# EAGLE design duckypad (EAGLE 9.6.2)
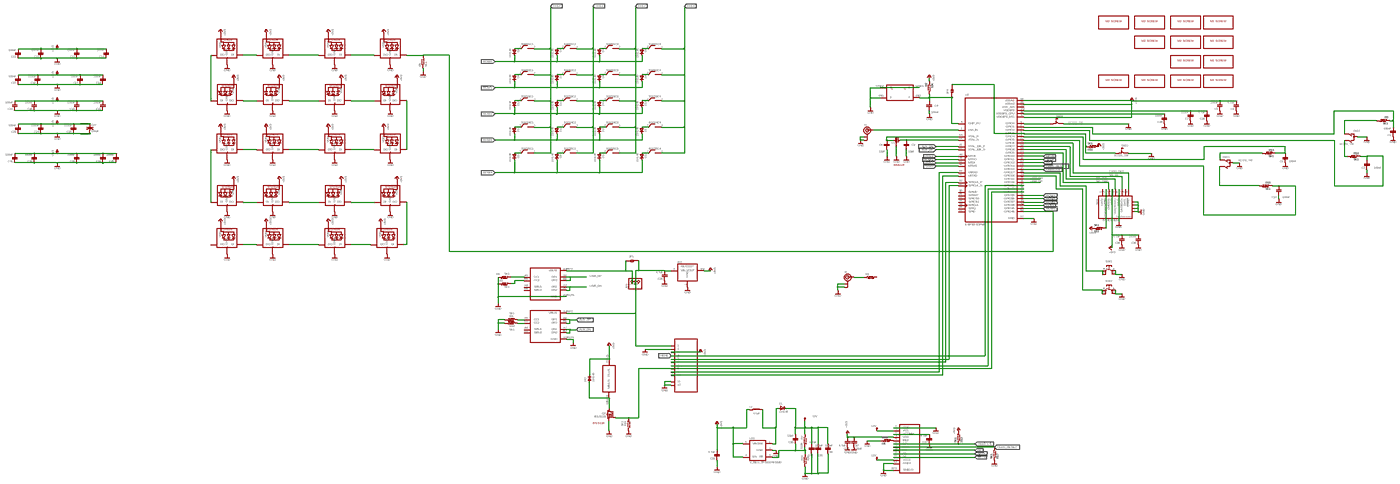
[diagram p0: schematic, sheet 1, overview]
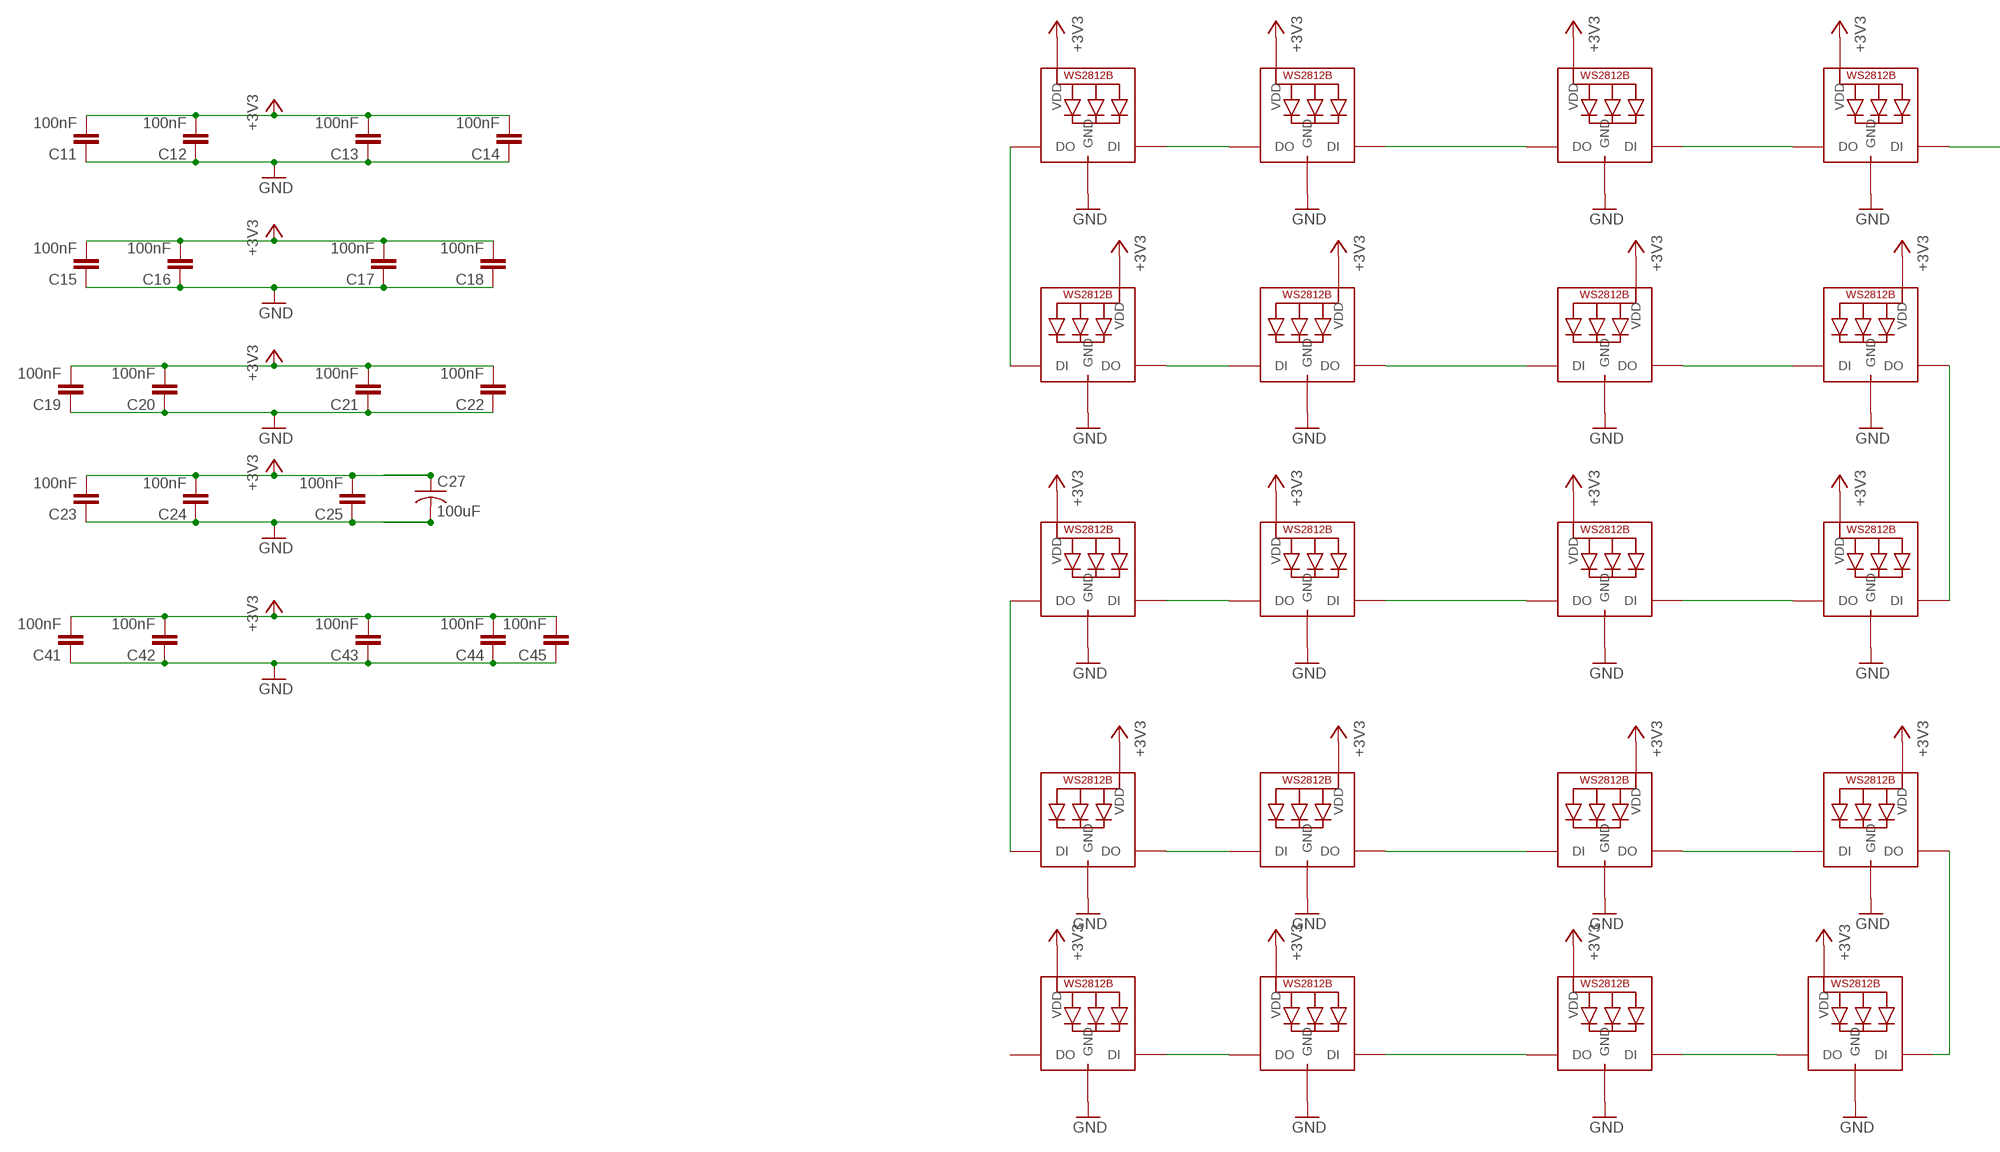
[diagram p1: schematic, sheet 1, part 1 of 4]
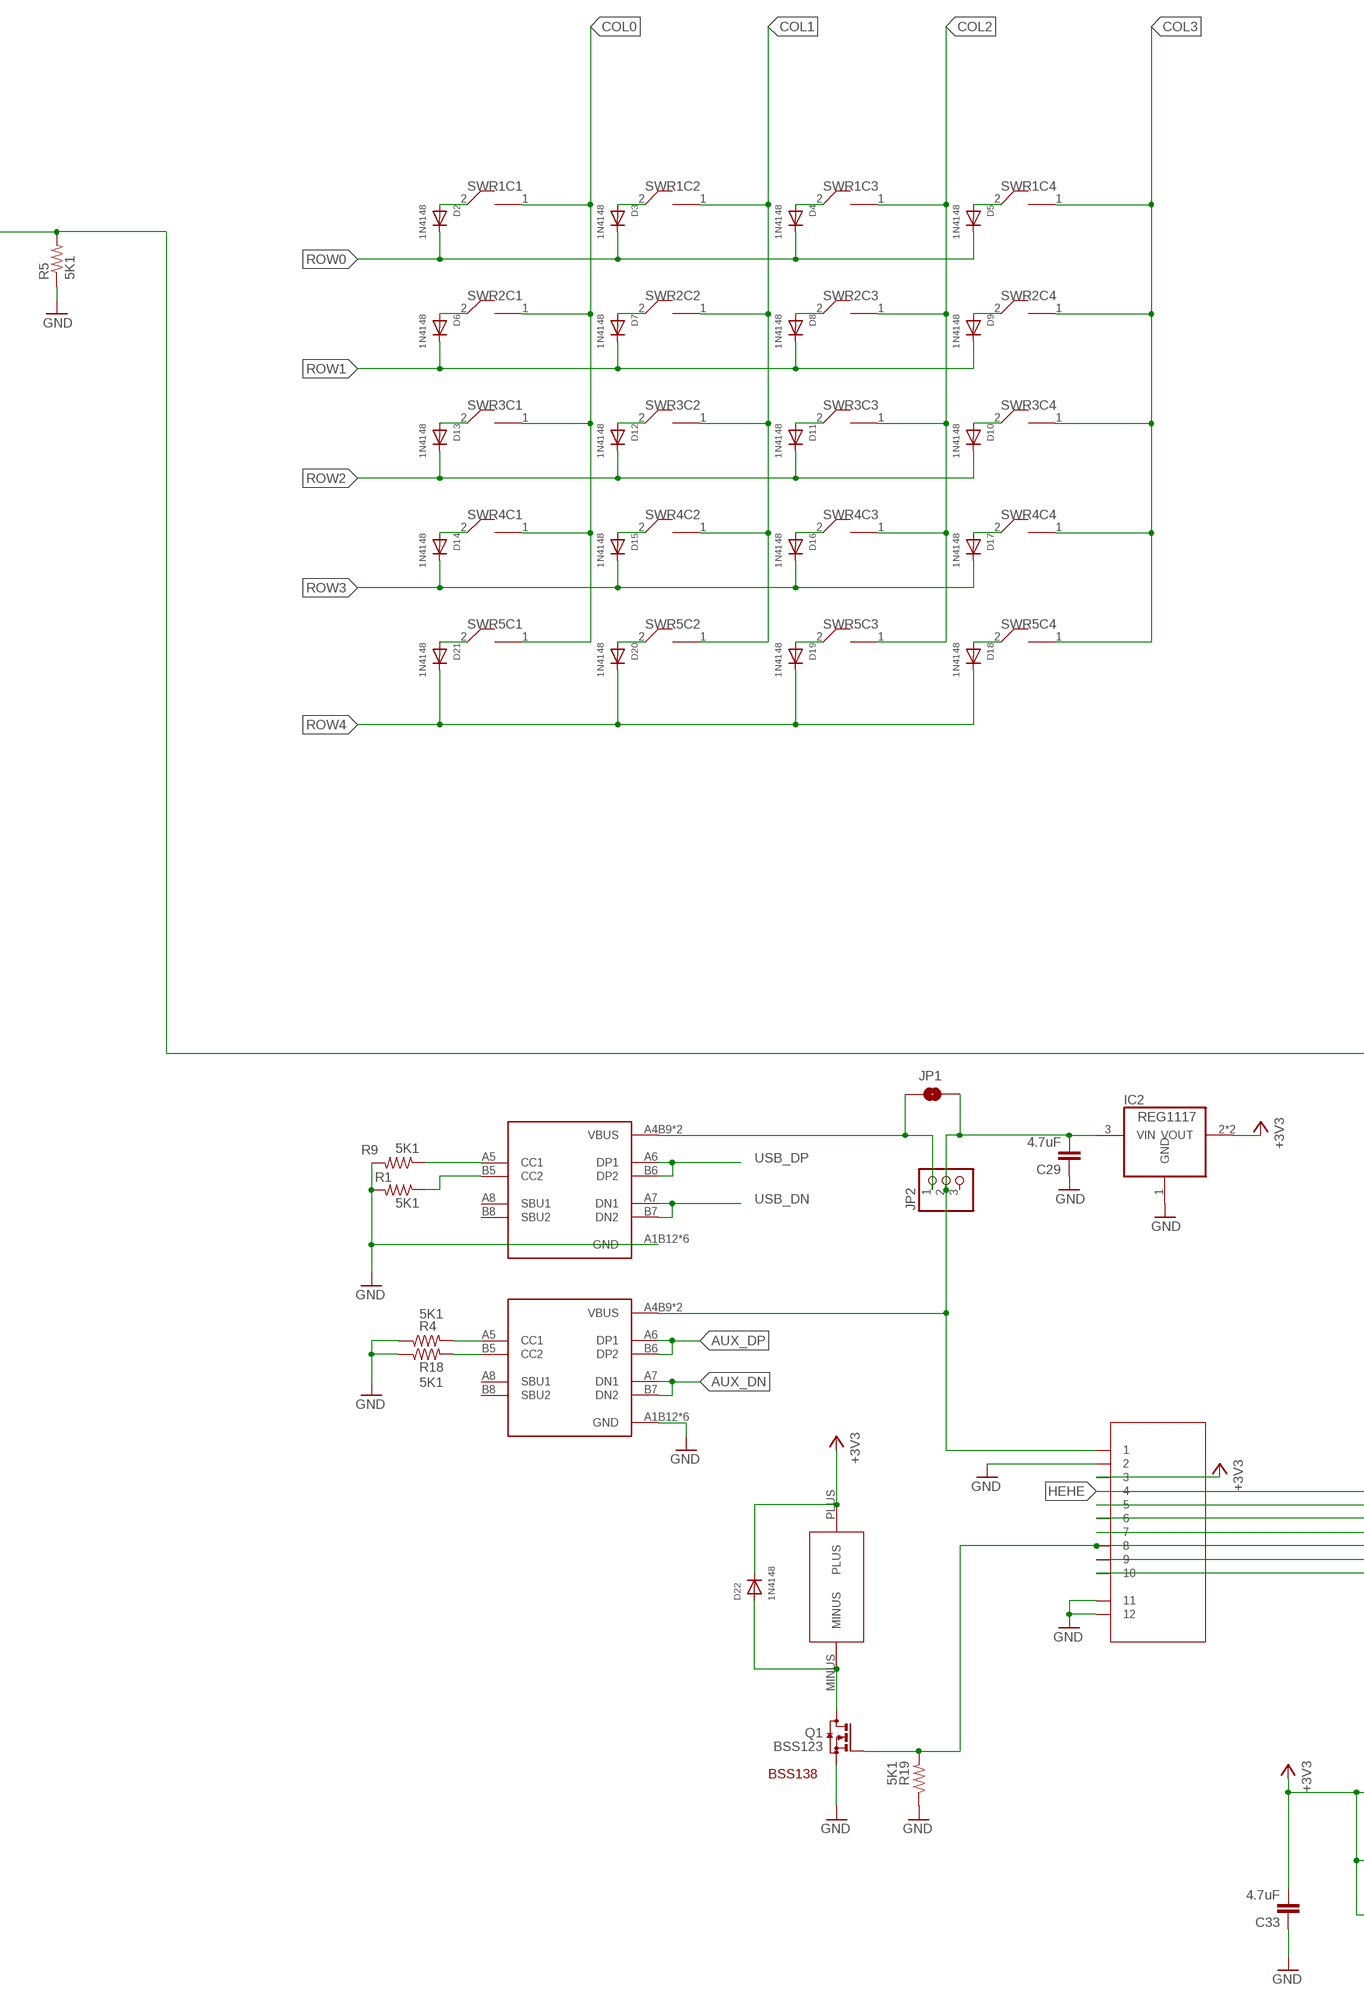
[diagram p2: schematic, sheet 1, part 2 of 4]
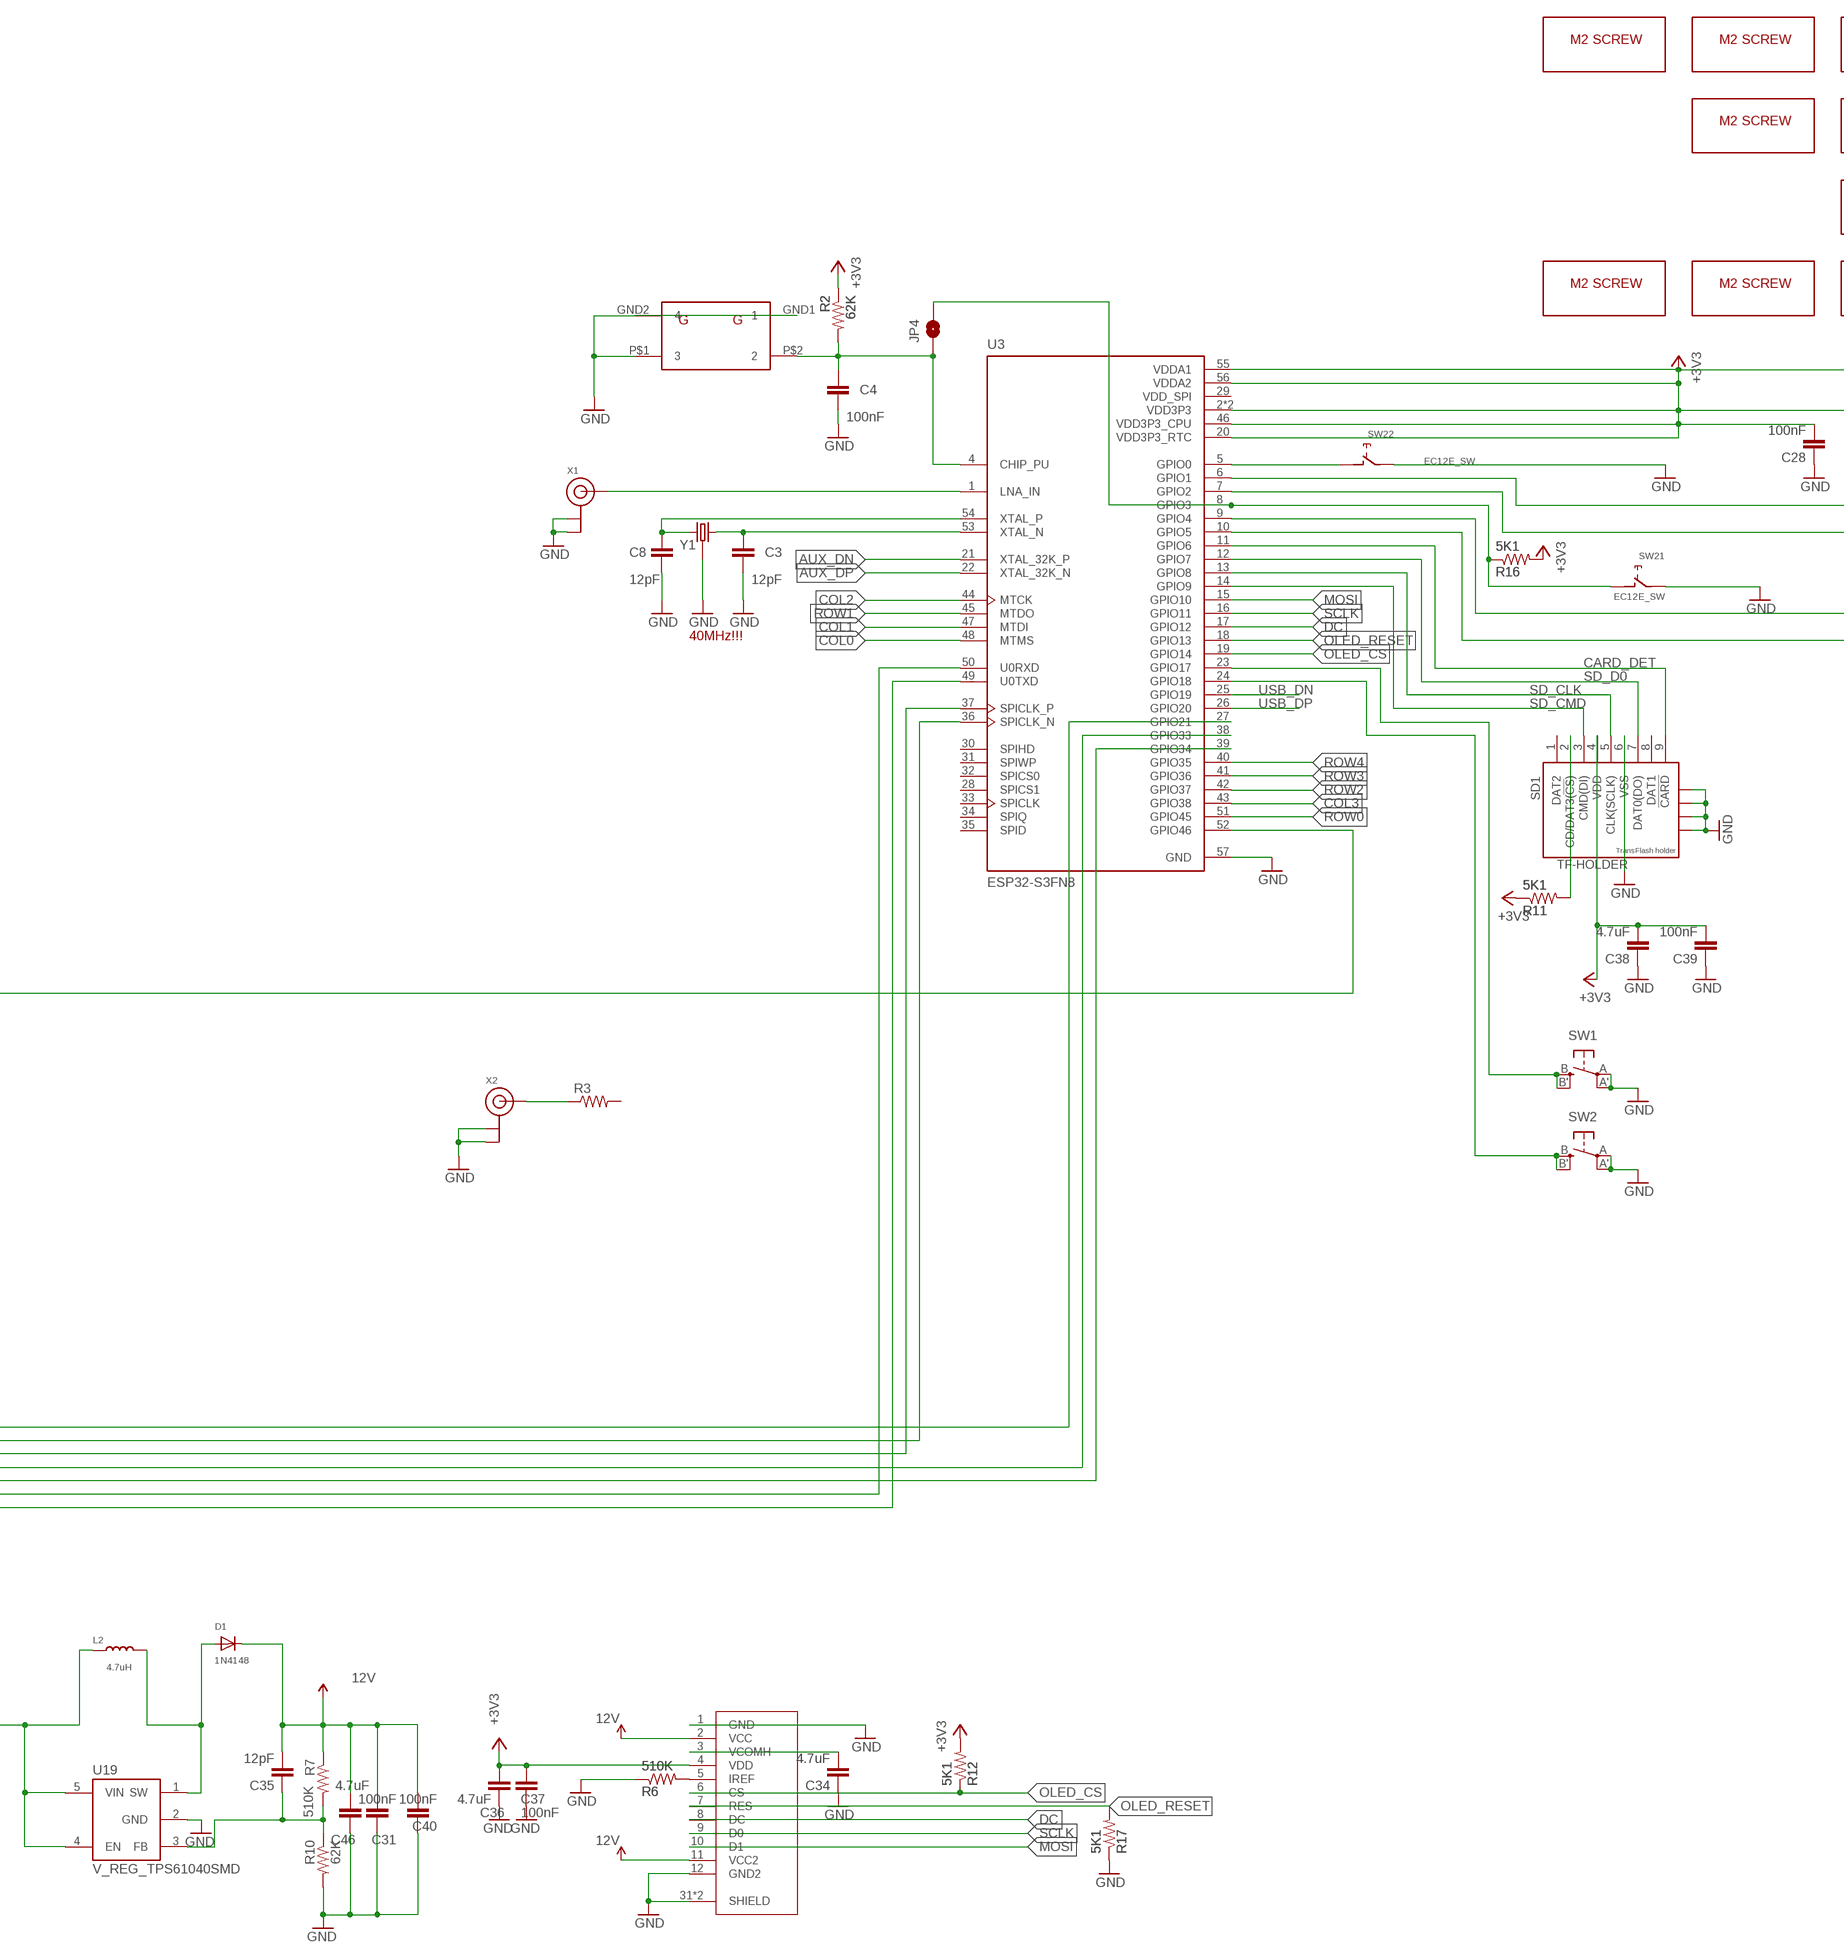
[diagram p3: schematic, sheet 1, part 3 of 4]
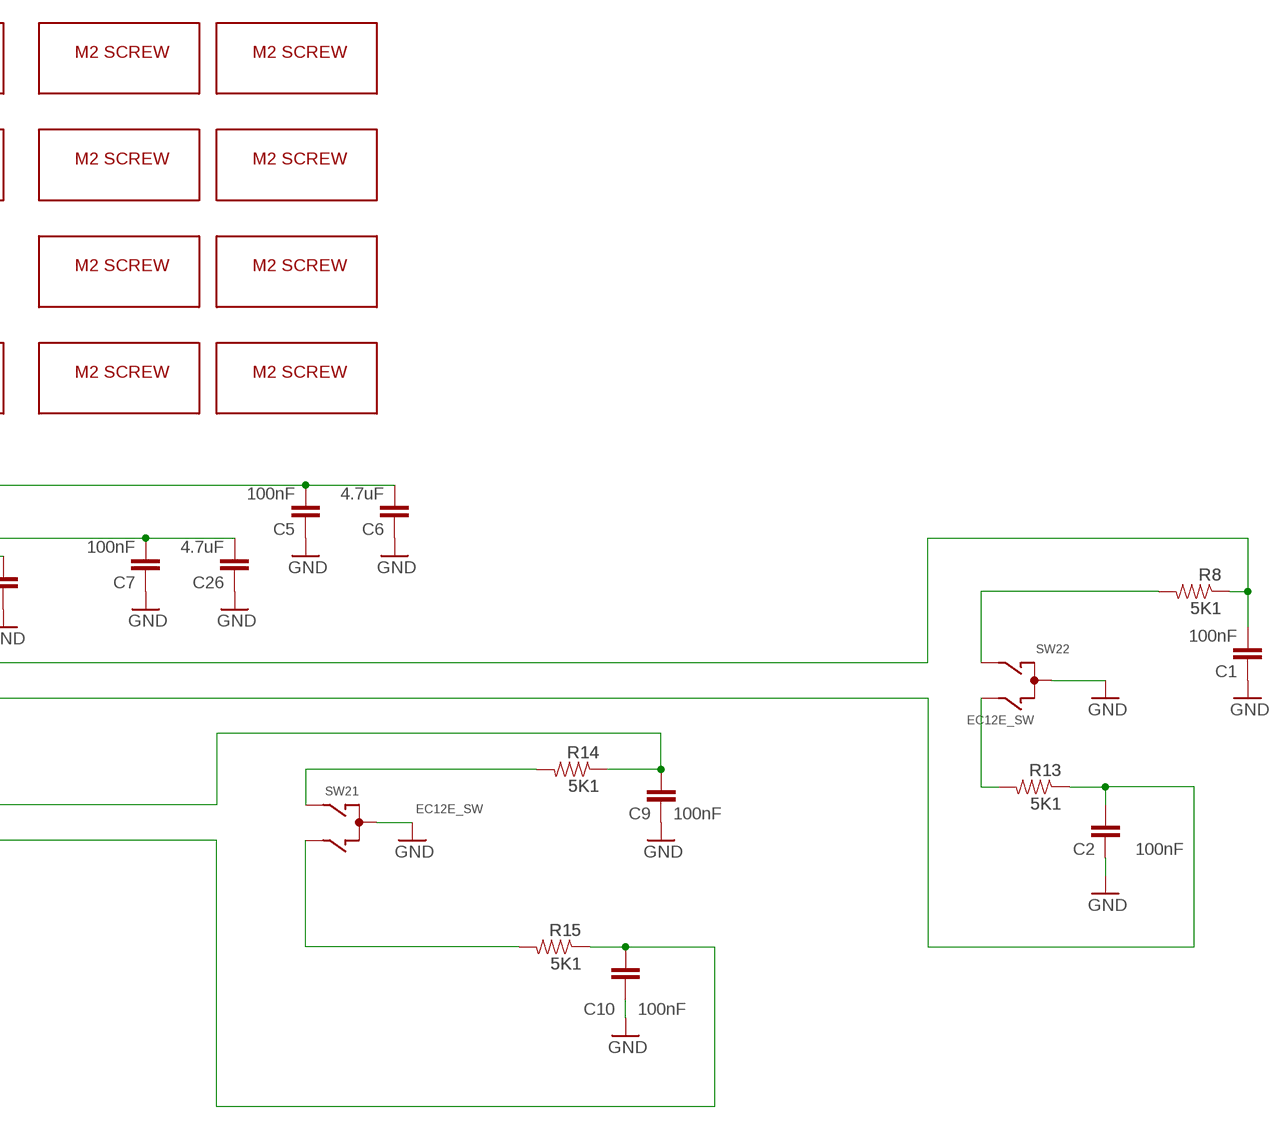
[diagram p4: schematic, sheet 1, part 4 of 4]

## Parts
BZ1  BUZZ40402  [BUZZ]
C1  100nF  CAP0805  [0805]
C2  100nF  CAP0805  [0805]
C3  12pF  CAP0805  [0805]
C4  100nF  CAP0805  [0805]
C5  100nF  CAP0805  [0805]
C6  4.7uF  CAP0805  [0805]
C7  100nF  CAP0805  [0805]
C8  12pF  CAP0805  [0805]
C9  100nF  CAP0805  [0805]
C10  100nF  CAP0805  [0805]
C11  100nF  CAP0805  [0805]
C12  100nF  CAP0805  [0805]
C13  100nF  CAP0805  [0805]
C14  100nF  CAP0805  [0805]
C15  100nF  CAP0805  [0805]
C16  100nF  CAP0805  [0805]
C17  100nF  CAP0805  [0805]
C18  100nF  CAP0805  [0805]
C19  100nF  CAP0805  [0805]
C20  100nF  CAP0805  [0805]
C21  100nF  CAP0805  [0805]
C22  100nF  CAP0805  [0805]
C23  100nF  CAP0805  [0805]
C24  100nF  CAP0805  [0805]
C25  100nF  CAP0805  [0805]
C26  4.7uF  CAP0805  [0805]
C27  100uF  C-USC1210  [C1210]
C28  100nF  CAP0805  [0805]
C29  4.7uF  CAP0805  [0805]
C31  100nF  CAP0805  [0805]
C33  4.7uF  CAP0805  [0805]
C34  4.7uF  CAP0805  [0805]
C35  12pF  CAP0805  [0805]
C36  4.7uF  CAP0805  [0805]
C37  100nF  CAP0805  [0805]
C38  4.7uF  CAP0805  [0805]
C39  100nF  CAP0805  [0805]
C40  100nF  CAP0805  [0805]
C41  100nF  CAP0805  [0805]
C42  100nF  CAP0805  [0805]
C43  100nF  CAP0805  [0805]
C44  100nF  CAP0805  [0805]
C45  100nF  CAP0805  [0805]
C46  4.7uF  CAP0805  [0805]
D1  1N4148  ADAFRUIT_CHANGED_DIODESOD-123  [ADAFRUIT_CHANGED_SOD-123]
D2  1N4148  ADAFRUIT_CHANGED_DIODESOD-123  [ADAFRUIT_CHANGED_SOD-123]
D3  1N4148  ADAFRUIT_CHANGED_DIODESOD-123  [ADAFRUIT_CHANGED_SOD-123]
D4  1N4148  ADAFRUIT_CHANGED_DIODESOD-123  [ADAFRUIT_CHANGED_SOD-123]
D5  1N4148  ADAFRUIT_CHANGED_DIODESOD-123  [ADAFRUIT_CHANGED_SOD-123]
D6  1N4148  ADAFRUIT_CHANGED_DIODESOD-123  [ADAFRUIT_CHANGED_SOD-123]
D7  1N4148  ADAFRUIT_CHANGED_DIODESOD-123  [ADAFRUIT_CHANGED_SOD-123]
D8  1N4148  ADAFRUIT_CHANGED_DIODESOD-123  [ADAFRUIT_CHANGED_SOD-123]
D9  1N4148  ADAFRUIT_CHANGED_DIODESOD-123  [ADAFRUIT_CHANGED_SOD-123]
D10  1N4148  ADAFRUIT_CHANGED_DIODESOD-123  [ADAFRUIT_CHANGED_SOD-123]
D11  1N4148  ADAFRUIT_CHANGED_DIODESOD-123  [ADAFRUIT_CHANGED_SOD-123]
D12  1N4148  ADAFRUIT_CHANGED_DIODESOD-123  [ADAFRUIT_CHANGED_SOD-123]
D13  1N4148  ADAFRUIT_CHANGED_DIODESOD-123  [ADAFRUIT_CHANGED_SOD-123]
D14  1N4148  ADAFRUIT_CHANGED_DIODESOD-123  [ADAFRUIT_CHANGED_SOD-123]
D15  1N4148  ADAFRUIT_CHANGED_DIODESOD-123  [ADAFRUIT_CHANGED_SOD-123]
D16  1N4148  ADAFRUIT_CHANGED_DIODESOD-123  [ADAFRUIT_CHANGED_SOD-123]
D17  1N4148  ADAFRUIT_CHANGED_DIODESOD-123  [ADAFRUIT_CHANGED_SOD-123]
D18  1N4148  ADAFRUIT_CHANGED_DIODESOD-123  [ADAFRUIT_CHANGED_SOD-123]
D19  1N4148  ADAFRUIT_CHANGED_DIODESOD-123  [ADAFRUIT_CHANGED_SOD-123]
D20  1N4148  ADAFRUIT_CHANGED_DIODESOD-123  [ADAFRUIT_CHANGED_SOD-123]
D21  1N4148  ADAFRUIT_CHANGED_DIODESOD-123  [ADAFRUIT_CHANGED_SOD-123]
D22  1N4148  ADAFRUIT_CHANGED_DIODESOD-123  [ADAFRUIT_CHANGED_SOD-123]
IC2  REG1117  [SOT223]
JP1  JUMPER-SMT_2_NO_NO-SILK  [SMT-JUMPER_2_NO_NO-SILK]
JP2  PINHD-1X3CB  [1X03-CLEANBIG]
JP4  JUMPER-SMT_2_NO_NO-SILK  [SMT-JUMPER_2_NO_NO-SILK]
L2  4.7uH  L-4030  [L4030]
LED_R1C1  WS2812B  [REVERSE_MNT]
LED_R1C2  WS2812B  [REVERSE_MNT]
LED_R1C3  WS2812B  [REVERSE_MNT]
LED_R1C4  WS2812B  [REVERSE_MNT]
LED_R2C1  WS2812B  [REVERSE_MNT]
LED_R2C2  WS2812B  [REVERSE_MNT]
LED_R2C3  WS2812B  [REVERSE_MNT]
LED_R2C4  WS2812B  [REVERSE_MNT]
LED_R3C1  WS2812B  [REVERSE_MNT]
LED_R3C2  WS2812B  [REVERSE_MNT]
LED_R3C3  WS2812B  [REVERSE_MNT]
LED_R3C4  WS2812B  [REVERSE_MNT]
LED_R4C1  WS2812B  [REVERSE_MNT]
LED_R4C2  WS2812B  [REVERSE_MNT]
LED_R4C3  WS2812B  [REVERSE_MNT]
LED_R4C4  WS2812B  [REVERSE_MNT]
LED_R5C1  WS2812B  [REVERSE_MNT]
LED_R5C2  WS2812B  [REVERSE_MNT]
LED_R5C3  WS2812B  [REVERSE_MNT]
LED_R5C4  WS2812B  [REVERSE_MNT]
Q1  BSS123  [SOT23]
R1  5K1  RESISTOR0805-RES  [0805]
R2  62K  RESISTOR0805-RES  [0805]
R3  R-US_R2010  [R2010]
R4  5K1  RESISTOR0805-RES  [0805]
R5  5K1  RESISTOR0805-RES  [0805]
R6  510K  RESISTOR0805-RES  [0805]
R7  510K  RESISTOR0805-RES  [0805]
R8  5K1  RESISTOR0805-RES  [0805]
R9  5K1  RESISTOR0805-RES  [0805]
R10  62K  RESISTOR0805-RES  [0805]
R11  5K1  RESISTOR0805-RES  [0805]
R12  5K1  RESISTOR0805-RES  [0805]
R13  5K1  RESISTOR0805-RES  [0805]
R14  5K1  RESISTOR0805-RES  [0805]
R15  5K1  RESISTOR0805-RES  [0805]
R16  5K1  RESISTOR0805-RES  [0805]
R17  5K1  RESISTOR0805-RES  [0805]
R18  5K1  RESISTOR0805-RES  [0805]
R19  5K1  RESISTOR0805-RES  [0805]
SD1  TF-HOLDER  [TF-PULL]
SH1  SH10P  [DUCKYPAD_SM12B-SSR-H-TB]
SW1  SPST_TACT-EVQQ2  [EVQ-Q2]
SW2  SPST_TACT-EVQQ2  [EVQ-Q2]
SW3  3POS_SLIDE_SWITCH_324_SW  [SIDEPUSH]
SW21  EC12E_SW  [ALPS_EC12E_SW]
SW22  EC12E_SW  [ALPS_EC12E_SW]
SWR1C1  KAILH_SWITCH_SOCKET_KAILH_SWITCH_SOCKET  [KAILH_SWITCH_SOCKET_SWITCH_SOCKET]
SWR1C2  KAILH_SWITCH_SOCKET_KAILH_SWITCH_SOCKET  [KAILH_SWITCH_SOCKET_SWITCH_SOCKET]
SWR1C3  KAILH_SWITCH_SOCKET_KAILH_SWITCH_SOCKET  [KAILH_SWITCH_SOCKET_SWITCH_SOCKET]
SWR1C4  KAILH_SWITCH_SOCKET_KAILH_SWITCH_SOCKET  [KAILH_SWITCH_SOCKET_SWITCH_SOCKET]
SWR2C1  KAILH_SWITCH_SOCKET_KAILH_SWITCH_SOCKET  [KAILH_SWITCH_SOCKET_SWITCH_SOCKET]
SWR2C2  KAILH_SWITCH_SOCKET_KAILH_SWITCH_SOCKET  [KAILH_SWITCH_SOCKET_SWITCH_SOCKET]
SWR2C3  KAILH_SWITCH_SOCKET_KAILH_SWITCH_SOCKET  [KAILH_SWITCH_SOCKET_SWITCH_SOCKET]
SWR2C4  KAILH_SWITCH_SOCKET_KAILH_SWITCH_SOCKET  [KAILH_SWITCH_SOCKET_SWITCH_SOCKET]
SWR3C1  KAILH_SWITCH_SOCKET_KAILH_SWITCH_SOCKET  [KAILH_SWITCH_SOCKET_SWITCH_SOCKET]
SWR3C2  KAILH_SWITCH_SOCKET_KAILH_SWITCH_SOCKET  [KAILH_SWITCH_SOCKET_SWITCH_SOCKET]
SWR3C3  KAILH_SWITCH_SOCKET_KAILH_SWITCH_SOCKET  [KAILH_SWITCH_SOCKET_SWITCH_SOCKET]
SWR3C4  KAILH_SWITCH_SOCKET_KAILH_SWITCH_SOCKET  [KAILH_SWITCH_SOCKET_SWITCH_SOCKET]
SWR4C1  KAILH_SWITCH_SOCKET_KAILH_SWITCH_SOCKET  [KAILH_SWITCH_SOCKET_SWITCH_SOCKET]
SWR4C2  KAILH_SWITCH_SOCKET_KAILH_SWITCH_SOCKET  [KAILH_SWITCH_SOCKET_SWITCH_SOCKET]
SWR4C3  KAILH_SWITCH_SOCKET_KAILH_SWITCH_SOCKET  [KAILH_SWITCH_SOCKET_SWITCH_SOCKET]
SWR4C4  KAILH_SWITCH_SOCKET_KAILH_SWITCH_SOCKET  [KAILH_SWITCH_SOCKET_SWITCH_SOCKET]
SWR5C1  KAILH_SWITCH_SOCKET_KAILH_SWITCH_SOCKET  [KAILH_SWITCH_SOCKET_SWITCH_SOCKET]
SWR5C2  KAILH_SWITCH_SOCKET_KAILH_SWITCH_SOCKET  [KAILH_SWITCH_SOCKET_SWITCH_SOCKET]
SWR5C3  KAILH_SWITCH_SOCKET_KAILH_SWITCH_SOCKET  [KAILH_SWITCH_SOCKET_SWITCH_SOCKET]
SWR5C4  KAILH_SWITCH_SOCKET_KAILH_SWITCH_SOCKET  [KAILH_SWITCH_SOCKET_SWITCH_SOCKET]
U1  USBC_16P  [USBC_16P_FOOT]
U2  USBC_16P  [USBC_16P_FOOT]
U3  ESP32-S3FN8  [QFN40P700X700X90-57N]
U19  V_REG_TPS61040SMD  [SOT23-5]
U$2  OLED_OLED128  [OLED_LUL_UG-2864HSWEG01_1.3_WRAPAROUND]
U$7  M2_SCREW_DEV  [M2_SCREW_FOOT]
U$8  M2_SCREW_DEV  [M2_SCREW_FOOT]
U$9  M2_SCREW_DEV  [M2_SCREW_FOOT]
U$11  M2_SCREW_DEV  [M2_SCREW_FOOT]
U$12  M2_SCREW_DEV  [M2_SCREW_FOOT]
U$13  M2_SCREW_DEV  [M2_SCREW_FOOT]
U$14  M2_SCREW_DEV  [M2_SCREW_FOOT]
U$15  M2_SCREW_DEV  [M2_SCREW_FOOT]
U$16  M2_SCREW_DEV  [M2_SCREW_FOOT]
U$17  M2_SCREW_DEV  [M2_SCREW_FOOT]
U$20  M2_SCREW_DEV  [M2_SCREW_FOOT]
U$21  M2_SCREW_DEV  [M2_SCREW_FOOT]
U$22  M2_SCREW_DEV  [M2_SCREW_FOOT]
X1  ANTENNA_U.FL  [U.FL]
X2  ANTENNA_U.FL  [U.FL]
Y1  16MHz_12pF  CRYSTAL-26MHZSMD-3.2X2.5  [CRYSTAL-SMD-3.2X2.5MM]

## Nets
12V: C31.2 C35.2 C40.2 C46.2 D1.C R7.1 U$2.2(VCC) U$2.11(VCC2)
+3V3: BZ1.PLUS C5.2 C6.2 C7.2 C11.2 C12.2 C13.2 C14.2 C15.2 C16.2 C17.2 C18.2 C19.2 C20.2 C21.2 C22.2 C23.2 C24.2 C25.2 C26.2 C27.1 C28.2 C33.2 C36.2 C37.2 C38.2 C39.2 C41.2 C42.2 C43.2 C44.2 C45.2 D22.C IC2.2(VOUT) IC2.4(VOUT) L2.1 LED_R1C1.VDD LED_R1C2.VDD LED_R1C3.VDD LED_R1C4.VDD LED_R2C1.VDD LED_R2C2.VDD LED_R2C3.VDD LED_R2C4.VDD LED_R3C1.VDD LED_R3C2.VDD LED_R3C3.VDD LED_R3C4.VDD LED_R4C1.VDD LED_R4C2.VDD LED_R4C3.VDD LED_R4C4.VDD LED_R5C1.VDD LED_R5C2.VDD LED_R5C3.VDD LED_R5C4.VDD R2.1 R11.1 R12.2 R16.2 SD1.4(VDD) SH1.3 U3.2(VDD3P3) U3.3(VDD3P3) U3.20(VDD3P3_RTC) U3.46(VDD3P3_CPU) U3.55(VDDA1) U3.56(VDDA2) U19.4(EN) U19.5(VIN) U$2.4(VDD)
AUX_DN: U1.A7(DN1) U1.B7(DN2) U3.21(XTAL_32K_P)
AUX_DP: U1.A6(DP1) U1.B6(DP2) U3.22(XTAL_32K_N)
CARD_DET: SD1.9(!CARD) U3.11(GPIO6)
COL0: SWR1C1.1 SWR2C1.1 SWR3C1.1 SWR4C1.1 SWR5C1.1 U3.48(MTMS)
COL1: SWR1C2.1 SWR2C2.1 SWR3C2.1 SWR4C2.1 SWR5C2.1 U3.47(MTDI)
COL2: SWR1C3.1 SWR2C3.1 SWR3C3.1 SWR4C3.1 SWR5C3.1 U3.44(MTCK)
COL3: SWR1C4.1 SWR2C4.1 SWR3C4.1 SWR4C4.1 SWR5C4.1 U3.43(GPIO38)
DC: U3.17(GPIO12) U$2.8(DC)
GND: C1.1 C2.1 C3.2 C4.2 C5.1 C6.1 C7.1 C8.2 C9.1 C10.1 C11.1 C12.1 C13.1 C14.1 C15.1 C16.1 C17.1 C18.1 C19.1 C20.1 C21.1 C22.1 C23.1 C24.1 C25.1 C26.1 C27.2 C28.1 C29.1 C31.1 C33.1 C34.1 C36.1 C37.1 C38.1 C39.1 C40.1 C41.1 C42.1 C43.1 C44.1 C45.1 C46.1 IC2.1(GND) LED_R1C1.GND LED_R1C2.GND LED_R1C3.GND LED_R1C4.GND LED_R2C1.GND LED_R2C2.GND LED_R2C3.GND LED_R2C4.GND LED_R3C1.GND LED_R3C2.GND LED_R3C3.GND LED_R3C4.GND LED_R4C1.GND LED_R4C2.GND LED_R4C3.GND LED_R4C4.GND LED_R5C1.GND LED_R5C2.GND LED_R5C3.GND LED_R5C4.GND Q1.2(S) R1.2 R4.1 R5.1 R6.1 R9.2 R10.2 R17.1 R18.1 R19.1 SD1.6(VSS) SD1.S1 SD1.S2 SD1.S3 SD1.S4 SH1.2 SH1.FIT@1 SH1.FIT@2 SW1.A'(P1) SW1.A(P) SW2.A'(P1) SW2.A(P) SW3.GND1 SW3.GND2 SW3.P$1 SW21.C SW21.E SW22.C SW22.E U1.A1B12(GND) U1.B11A12(GND) U1.P$13(GND) U1.P$14(GND) U1.P$15(GND) U1.P$16(GND) U2.A1B12(GND) U2.B11A12(GND) U2.P$13(GND) U2.P$14(GND) U2.P$15(GND) U2.P$16(GND) U3.57(GND) U19.2(GND) U$2.1(GND) U$2.12(GND2) U$2.31(SHIELD) U$2.32(SHIELD) X1.1(GND) X1.2(GND) X2.1(GND) X2.2(GND) Y1.2 Y1.4
HEHE: SH1.4 U3.27(GPIO21)
MOSI: U3.15(GPIO10) U$2.10(D1)
N$1: JP1.1 JP2.1 U2.A4B9(VBUS) U2.B4A9(VBUS)
N$2: LED_R1C3.DIN(DI) LED_R1C4.DOUT(DO)
N$3: LED_R1C2.DIN(DI) LED_R1C3.DOUT(DO)
N$4: LED_R1C1.DIN(DI) LED_R1C2.DOUT(DO)
N$5: LED_R1C1.DOUT(DO) LED_R2C1.DIN(DI)
N$6: LED_R2C1.DOUT(DO) LED_R2C2.DIN(DI)
N$7: LED_R2C2.DOUT(DO) LED_R2C3.DIN(DI)
N$8: C34.2 U$2.3(VCOMH)
N$9: LED_R2C3.DOUT(DO) LED_R2C4.DIN(DI)
N$10: R6.2 U$2.5(IREF)
N$11: LED_R2C4.DOUT(DO) LED_R3C4.DIN(DI)
N$12: LED_R3C3.DIN(DI) LED_R3C4.DOUT(DO)
N$13: LED_R3C2.DIN(DI) LED_R3C3.DOUT(DO)
N$14: C9.2 R14.1 U3.9(GPIO4)
N$15: LED_R3C1.DIN(DI) LED_R3C2.DOUT(DO)
N$16: LED_R3C1.DOUT(DO) LED_R4C1.DIN(DI)
N$17: LED_R4C1.DOUT(DO) LED_R4C2.DIN(DI)
N$18: LED_R4C2.DOUT(DO) LED_R4C3.DIN(DI)
N$19: LED_R4C3.DOUT(DO) LED_R4C4.DIN(DI)
N$20: LED_R4C4.DOUT(DO) LED_R5C4.DIN(DI)
N$21: LED_R5C3.DIN(DI) LED_R5C4.DOUT(DO)
N$22: LED_R5C2.DIN(DI) LED_R5C3.DOUT(DO)
N$23: LED_R5C1.DIN(DI) LED_R5C2.DOUT(DO)
N$24: C8.1 U3.54(XTAL_P) Y1.1
N$25: C3.1 U3.53(XTAL_N) Y1.3
N$26: U3.1(LNA_IN) X1.3(SIGNAL)
N$27: D5.A SWR1C4.2
N$28: SW22.D U3.5(GPIO0)
N$29: LED_R1C4.DIN(DI) R5.2 U3.52(GPIO46)
N$30: SW1.B'(S1) SW1.B(S) U3.23(GPIO17)
N$31: R1.1 U2.B5(CC2)
N$32: R4.2 U1.A5(CC1)
N$33: R9.1 U2.A5(CC1)
N$34: R8.2 SW22.A
N$35: R13.2 SW22.B
N$36: D1.A L2.2 U19.1(SW)
N$37: BZ1.MINUS D22.A Q1.3(D)
N$38: C1.2 R8.1 U3.6(GPIO1)
N$39: C35.1 R7.2 R10.1 U19.3(FB)
N$40: C2.2 R13.1 U3.7(GPIO2)
N$41: JP4.2 R16.1 SW21.D U3.8(GPIO3)
N$42: R15.2 SW21.B
N$43: R11.2 SD1.2(CD/DAT3(!CS!))
N$44: D4.A SWR1C3.2
N$45: D3.A SWR1C2.2
N$46: D2.A SWR1C1.2
N$47: D9.A SWR2C4.2
N$48: R14.2 SW21.A
N$49: C10.2 R15.1 U3.10(GPIO5)
N$50: D8.A SWR2C3.2
N$51: D7.A SWR2C2.2
N$52: D6.A SWR2C1.2
N$53: D10.A SWR3C4.2
N$54: D11.A SWR3C3.2
N$55: D12.A SWR3C2.2
N$56: D13.A SWR3C1.2
N$57: D17.A SWR4C4.2
N$58: D16.A SWR4C3.2
N$59: D15.A SWR4C2.2
N$60: D14.A SWR4C1.2
N$61: D18.A SWR5C4.2
N$62: D19.A SWR5C3.2
N$63: D20.A SWR5C2.2
N$64: D21.A SWR5C1.2
N$65: SW2.B'(S1) SW2.B(S) U3.24(GPIO18)
N$66: C29.2 IC2.3(VIN) JP1.2 JP2.2 SH1.1 U1.A4B9(VBUS) U1.B4A9(VBUS)
N$67: SH1.5 U3.36(SPICLK_N)
N$68: SH1.6 U3.37(SPICLK_P)
N$69: SH1.7 U3.38(GPIO33)
N$70: Q1.1(G) R19.2 SH1.8 U3.39(GPIO34)
N$71: R3.1 X2.3(SIGNAL)
N$72: SH1.9 U3.50(U0RXD)
N$73: SH1.10 U3.49(U0TXD)
N$80: R18.2 U1.B5(CC2)
OLED_CS: R12.1 U3.19(GPIO14) U$2.6(CS)
OLED_RESET: R17.2 U3.18(GPIO13) U$2.7(RES)
RESET: C4.1 JP4.1 R2.2 SW3.P$2 U3.4(CHIP_PU)
ROW0: D2.C D3.C D4.C D5.C U3.51(GPIO45)
ROW1: D6.C D7.C D8.C D9.C U3.45(MTDO)
ROW2: D10.C D11.C D12.C D13.C U3.42(GPIO37)
ROW3: D14.C D15.C D16.C D17.C U3.41(GPIO36)
ROW4: D18.C D19.C D20.C D21.C U3.40(GPIO35)
SCLK: U3.16(GPIO11) U$2.9(D0)
SD_CLK: SD1.5(CLK(SCLK)) U3.13(GPIO8)
SD_CMD: SD1.3(CMD(DI)) U3.14(GPIO9)
SD_D0: SD1.7(DAT0(DO)) U3.12(GPIO7)
USB_DN: U2.A7(DN1) U2.B7(DN2) U3.25(GPIO19)
USB_DP: U2.A6(DP1) U2.B6(DP2) U3.26(GPIO20)
Unconnected: JP2.3 LED_R5C1.DOUT(DO) R3.2 SD1.1(DAT2) SD1.8(DAT1) SW21.GND1(G) SW21.GND2(G) SW22.GND1(G) SW22.GND2(G) U1.A8(SBU1) U1.B8(SBU2) U2.A8(SBU1) U2.B8(SBU2) U3.28(SPICS1) U3.30(SPIHD) U3.31(SPIWP) U3.32(SPICS0) U3.33(SPICLK) U3.34(SPIQ) U3.35(SPID)

## Notes on the sheet
- 40MHz!!!
- BSS138

## Power pins joined to a net without a drawn wire
VDD_SPI: U3.29(VDD_SPI)

## Library data of the parts
BZ1 = duckypad:BUZZ40402
C1-C26 C28 C29 C31 C33-C46 = clock:CAP: Capacitor Standard 0603 ceramic capacitor, and 0.1" leaded capacitor.
C27 = clock:C-US: CAPACITOR, American symbol
D1-D22 = duckypad:ADAFRUIT_CHANGED_DIODE: Diode SMADIODE - SMA Surface Mount Package 20V 1A Schottky Diode Digikey: 641-1014-6-ND DO-1N4148 - Through Hole Small Current Diode SOD-123 20V 1 A (.5mV Vf) Schottky Diode - Digikey: MBRX120TPMSCT-ND SOD-323 10V 570mA (.38mV Vf, 3ns) Schottky Diode - Digikey: ZLLS410CT-ND SOD-523 30V 30mA Schottky Diode (RB751S-40TE61) - Digikey: RB751S-40TE61CT-ND SOT23-R/W - SOT23 Package (R = Solder Paste/Reflow Ovens, W = Hand-Soldering) BAT54Film 40V 300mA - Digikey: 497-7162-1-ND
IC2 = clock:REG1117: 800mA and 1A Low Dropout (LDO) Positive Regulator 1.8V, 2.5V, 2.85V, 3.3V, 5V, and Adj; MPN: REG1117; OC_FARNELL: 1097566; OC_NEWARK: 14P6981
JP1 JP4 = SparkFun-Jumpers:JUMPER-SMT_2_NO: Normally open jumper This jumper has two pads in close proximity to each other. Apply solder to close the connection. Round pads are easier to solder for beginners, but are a lot larger. SparkFun Product that uses the round pads: SparkFun EL Sequencer <https://www.sparkfun.com/products/12781>
JP2 = adafruit_changed:PINHD-1X3: PIN HEADER
L2 = Discrete:L*
LED_R1C1-LED_R1C4 LED_R2C1-LED_R2C4 LED_R3C1-LED_R3C4 LED_R4C1-LED_R4C4 LED_R5C1-LED_R5C4 = duckypad:WS2812B
Q1 = transistor-small-signal:BSS123: N-CHANNEL MOS FET
R1 R2 R4 R6-R19 = joyAnalog:RESISTOR: Resistor Basic schematic elements and footprints for 0603, 1206, and PTH resistors.
R3 = adafruit_changed:R-US_: RESISTOR, American symbol
R5 = clock:RESISTOR: Resistor Basic schematic elements and footprints for 0603, 1206, and PTH resistors.
SD1 = clock:TF-HOLDER: TF / Micro SD socket is PUSH-PUSH type, the card can be pushed into and auto locked and pushed out by simply press the card. Surface Mounting type.
SH1 = duckypad:SH10P
SW1 SW2 = duckypad:SPST_TACT: SMT 6mm switch, EVQQ2 series http://www.ladyada.net/library/eagle
SW3 = duckypad:3POS_SLIDE_SWITCH_324_SW
SW21 SW22 = switch-alps:EC12E_SW: ALPS rotary Encoder EC12E series with switch; MPN: EC12E2424407; OC_FARNELL: 1520813; OC_NEWARK: 74M1068
SWR1C1-SWR1C4 SWR2C1-SWR2C4 SWR3C1-SWR3C4 SWR4C1-SWR4C4 SWR5C1-SWR5C4 = lul:KAILH_SWITCH_SOCKET_KAILH_SWITCH_SOCKET
U1 U2 = my_usbc_16p:USBC_16P
U3 = ESP32-S3FN8:ESP32-S3FN8: Check availability <https://pricing.snapeda.com/parts/ESP32-S3FN8/Espressif%20Systems/view-part?ref=eda> Check availability <https://pricing.snapeda.com/parts/ESP32-S3FN8/Espressif%20Systems/view-part?ref=eda> Check availability <https://pricing.snapeda.com/parts/ESP32-S3FN8/Espressif%20Systems/view-part?ref=eda>; AVAILABILITY: In Stock; CHECK_PRICES: https://www.snapeda.com/parts/ESP32-S3FN8/Espressif+Systems/view-part/?ref=eda; DESCRIPTION: Espressif Systems [ENGINEERING SAMPLES]SMD IC , Dual-Core MCU, Wi-Fi 2.4G & BLE 5.0 combo, 8 MB Octal SPI PSRAM, QFN 56-pin, 7*7 mm; MF: Espressif Systems; MP: ESP32-S3FN8; PACKAGE: None; PRICE: None; SNAPEDA_LINK: https://www.snapeda.com/parts/ESP32-S3FN8/Espressif+Systems/view-part/?ref=snap
U19 = SparkFun-Retired:V_REG_TPS61040
U$2 = duckypad:OLED_OLED128
U$7-U$9 U$11-U$17 U$20-U$22 = duckypad:M2_SCREW_DEV
X1 X2 = adafruit_changed:ANTENNA_U.FL: U.FL Antenna Connector
Y1 = SparkFun-Clocks:CRYSTAL-26MHZ: 26MHz Crystal w/ Ground Pin Digikey Example <http://www.digikey.com/product-detail/en/epson/TSX-3225%2026.0000MF09Z-AC3/SER3627CT-ND/1802878> Frequency: 26MHz Frequency Stability: ±9ppm Frequency Tolerance: ±10ppm Load Capacitance: 9pF SparkFun Products: SparkFun ESP32 Thing <https://www.sparkfun.com/products/13907> SparkFun ESP8266 Thing Dev Board <https://www.sparkfun.com/products/13711>; PROD_ID: XTAL-12454

## Board
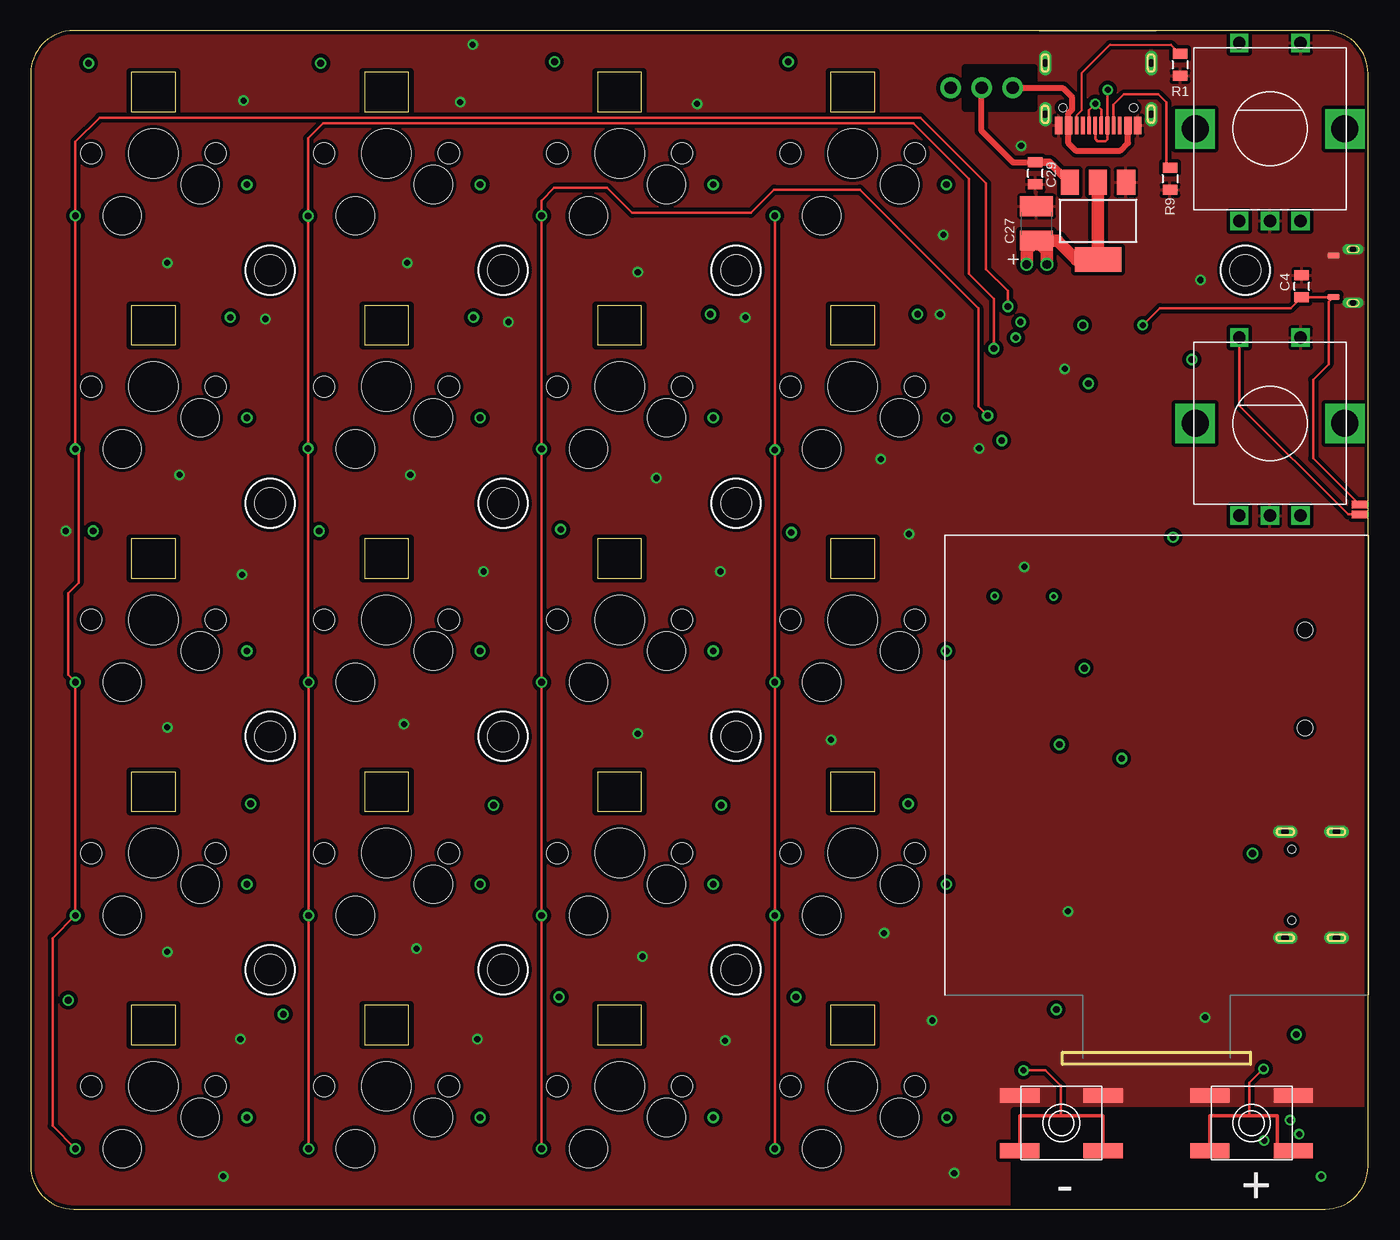
[diagram p5: board, top side]
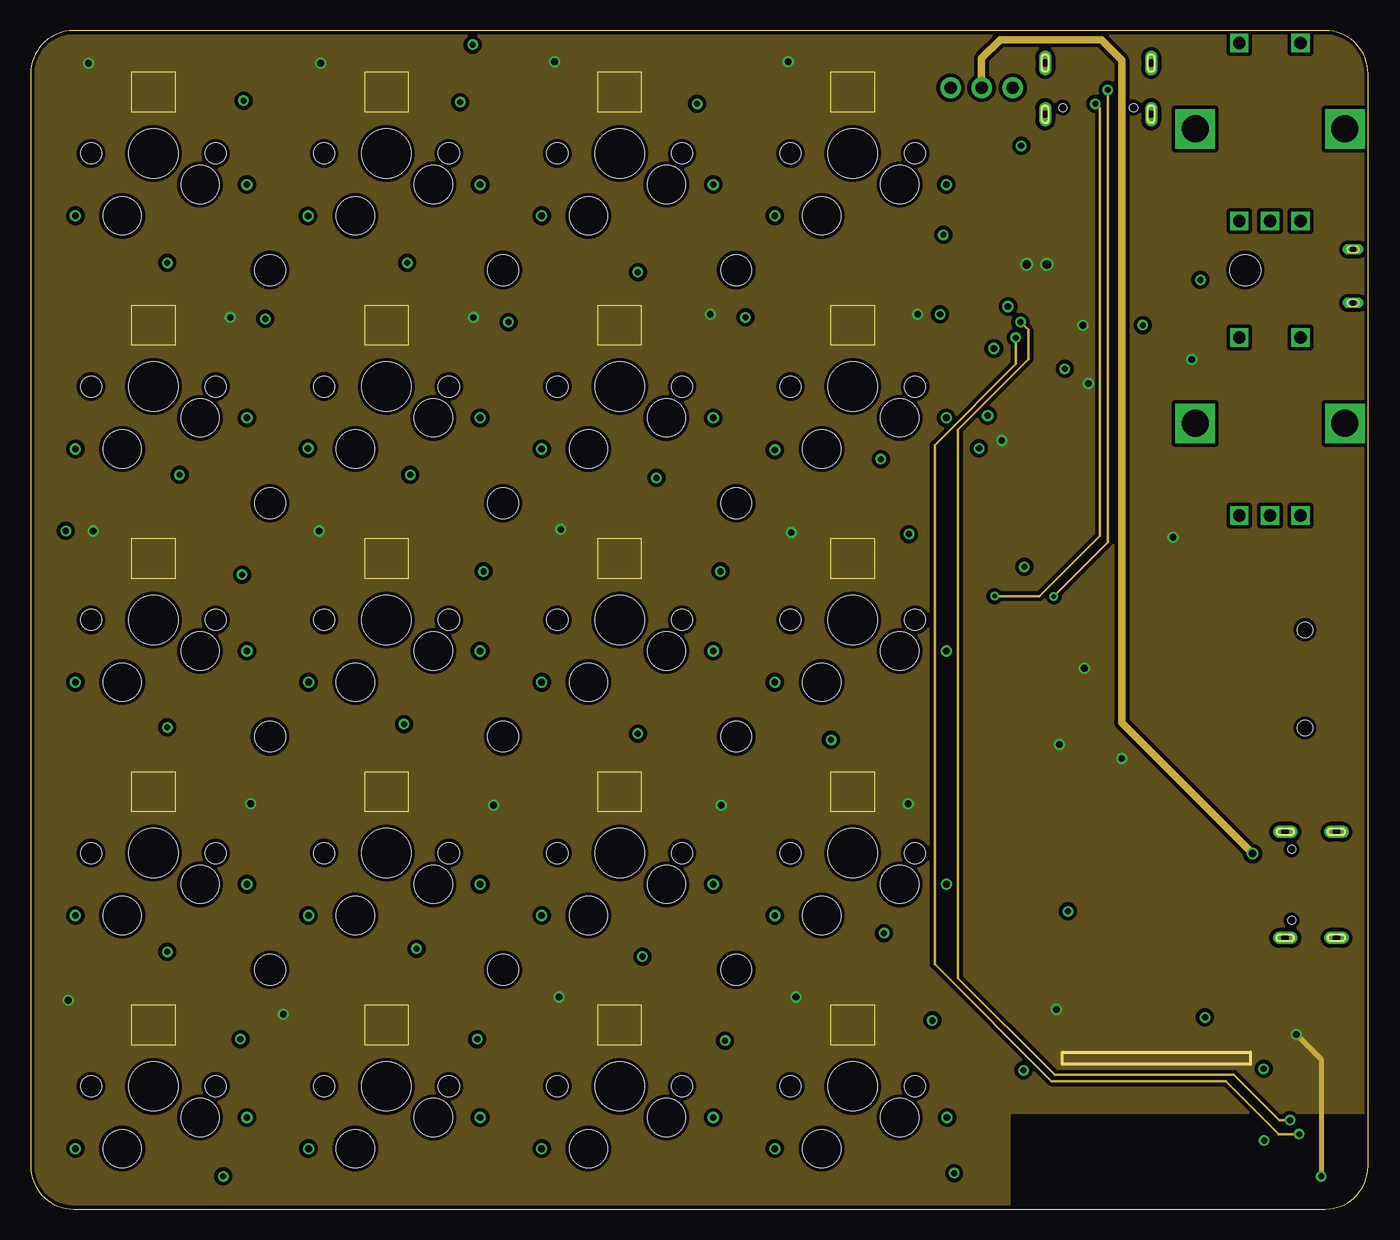
[diagram p6: board, inner layer pwr]
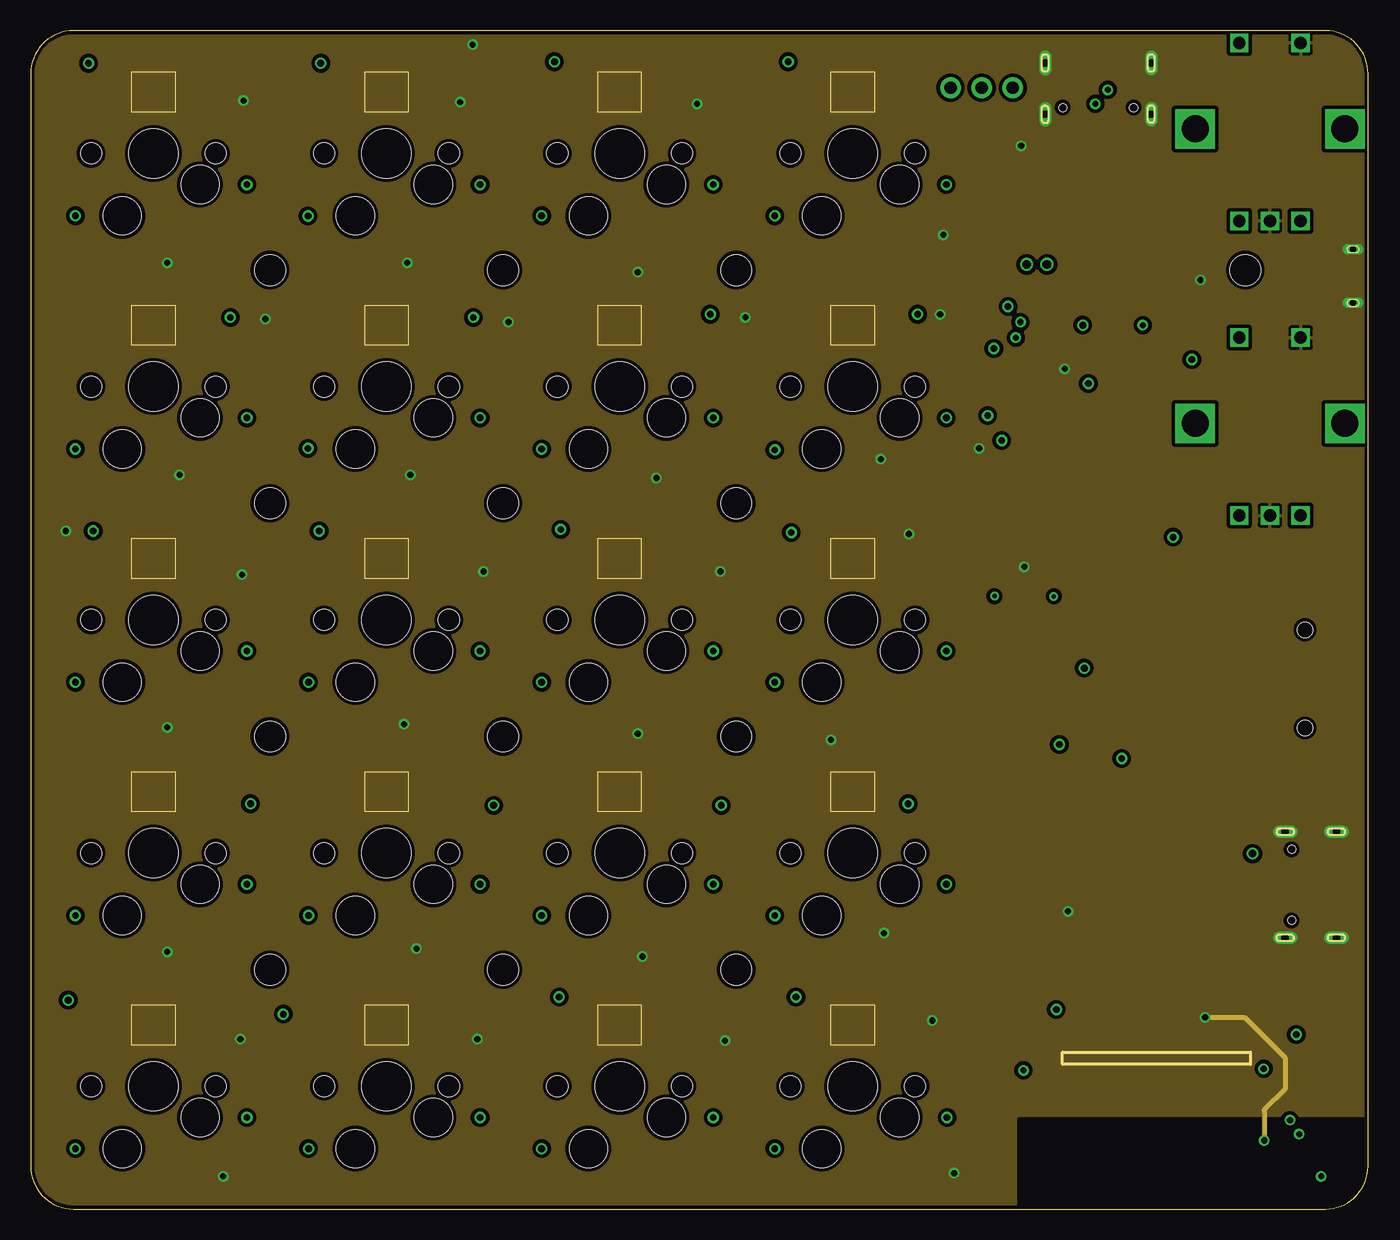
[diagram p7: board, inner layer gnd]
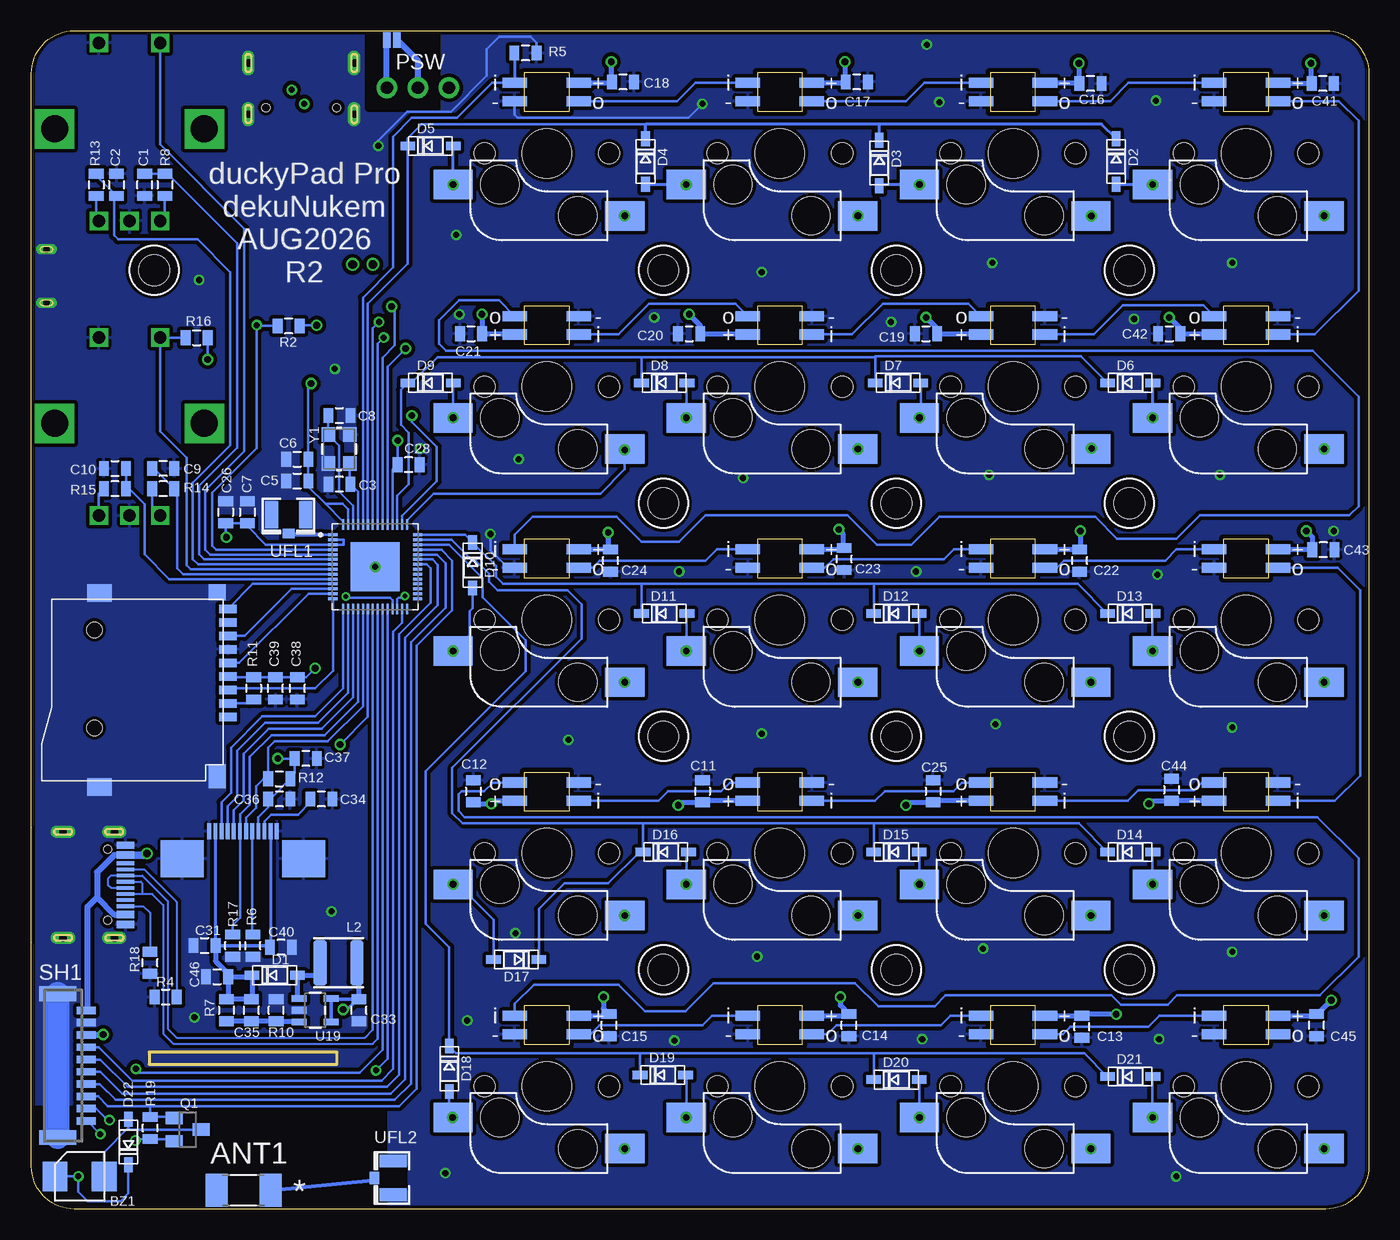
[diagram p8: board, bottom side, seen from below]

Size 109 x 96 mm. Coordinates in mm from the lower left corner, seen from the top.
Outline: 105.5,96 3.5,96 arc90 0,92.5 0,3.5 arc90 3.5,0 105.5,0 arc90 109,3.5 109,92.5 arc90 105.5,96
Copper layers (1+2*15+16): Top 0.035559375mm / dielectric 0.47751875mm / pwr 0.035559375mm / dielectric 0.47751875mm / gnd 0.035559375mm / dielectric 0.47751875mm / Bottom 0.035559375mm
Design rules "SparkFun-4-Layer-General-JLCPCB *": minimum track width 6mil, minimum drill 12mil, track to track 6mil, track to pad 6mil, pad to pad 6mil, via to via 6mil, smd to smd 6mil, copper to edge 6mil, drill to drill 6mil, minimum pad ring 7mil, minimum via ring 7mil, stop-mask expansion 3mil, vias tented up to drill 25mil, thermal gap 10mil
tRestrict: area 80.2,-1.9 to 112.4,8; area 76.2,89.7 to 81.8,93
bRestrict: area 80.3,-1.8 to 112.5,8.1; area 75.9,89.7 to 81.5,93; area 75.9,92.6 to 81.5,95.9; area 78.1,49.8 to 83.8,55.2

### Footprints (pad centres in the part's own frame; a part is rotated, then mirrored left to right if it is on the bottom)
BUZZ = smd 2 x 2.4: MINUS 4,0; PLUS 0,0
0805 = smd 0.8 x 1.2: 1 -0.9,0; 2 0.9,0
C1210 = smd 1.6 x 2.7: 1 -1.4,0; 2 1.4,0
ADAFRUIT_CHANGED_SOD-123 = smd 1.2 x 0.7: A 1.85,0; C -1.85,0
SOT223 = smd 1.499 x 2.007: 1 -2.261,-3.15; 2 0.025,-3.15; 3 2.311,-3.15 | smd 3.81 x 2.007: 4 0,3.15
SMT-JUMPER_2_NO_NO-SILK = smd 0.635 x 1.27: 1 -0.406,0; 2 0.406,0
1X03-CLEANBIG = drill 1.016 pad 1.676: 1 -2.54,0; 2 0,0; 3 2.54,0
L4030 = smd 1.1 x 3.7: 1 -1.5,0; 2 1.5,0
REVERSE_MNT = smd 2 x 0.82 bottom: DIN -2.6,-0.75; DOUT 2.6,0.75; GND -2.6,0.75; VDD 2.6,-0.75
SOT23 = smd 1 x 1.4: 1 -0.95,-1.1; 2 0.95,-1.1; 3 0,1.1
R2010 = smd 1.8 x 2.7: 1 -2.2,0; 2 2.2,0
TF-PULL = smd 0.7 x 1.4: 1 -2.2,-7.62; 2 -1.1,-7.62; 3 0,-7.62; 4 1.1,-7.62; 5 2.2,-7.62; 6 3.3,-7.62; 7 4.4,-7.62; 8 5.5,-7.62; 9 6.6,-7.62 | smd 1.4 x 2: S1 -7.9,2.85; S2 7.9,2.85 | smd 1.28 x 1.4: S3 7.96,-6.75 | smd 1.95 x 1.4: S4 -7.025,-6.75 | hole 1.25: -3.1,3.25; 4.9,3.25
DUCKYPAD_SM12B-SSR-H-TB = smd 0.6 x 1.55: 1 -4.5,1.925; 2 -3.5,1.925; 3 -2.5,1.925; 4 -1.5,1.925; 5 -0.5,1.925; 6 0.5,1.925; 7 1.5,1.925; 8 2.5,1.925; 9 3.5,1.925; 10 4.5,1.925 | smd 1.2 x 3: FIT@1 -5.85,-0.4; FIT@2 5.85,-0.4
EVQ-Q2 = smd 3.2 x 1.2: A -3.4,-2.25; A' 3.4,-2.25; B -3.4,2.25; B' 3.4,2.25
SIDEPUSH = drill 0.5 pad 0.8 long: GND1 -2.175,1.6; GND2 2.175,1.6 | smd 0.5 x 1: P$1 -1.7,0; P$2 1.7,0
ALPS_EC12E_SW = drill 1 square: A -2.5,-7.5; B 2.5,-7.5; C 0,-7.5; D -2.5,7; E 2.5,7 | drill 2.2 square: GND1 -6.1,0; GND2 6.1,0
KAILH_SWITCH_SOCKET_SWITCH_SOCKET = smd 3.2 x 2.4 bottom: 1 6.355,5.08; 2 -7.625,2.54 | hole 4: 0,0 | hole 3.1: -3.81,2.54; 2.54,5.08 | hole 1.7: -5.08,0; 5.08,0
USBC_16P_FOOT = smd 0.6 x 1.45: A1B12 -3.225,3.848; A4B9 -2.425,3.848; B4A9 2.425,3.848; B11A12 3.225,3.848 | smd 0.3 x 1.45: A5 -1.25,3.848; A6 -0.25,3.848; A7 0.25,3.848; A8 1.25,3.848; B5 1.75,3.848; B6 0.75,3.848; B7 -0.75,3.848; B8 -1.75,3.848 | drill 0.6 pad 1 long: P$13 -4.32,2.933; P$14 4.32,2.933; P$15 -4.32,-1.248; P$16 4.32,-1.248 | hole 0.65: -2.89,2.402; 2.89,2.402
QFN40P700X700X90-57N = smd 0.81 x 0.22: 1 -3.445,2.6; 2 -3.445,2.2; 3 -3.445,1.8; 4 -3.445,1.4; 5 -3.445,1; 6 -3.445,0.6; 7 -3.445,0.2; 8 -3.445,-0.2; 9 -3.445,-0.6; 10 -3.445,-1; 11 -3.445,-1.4; 12 -3.445,-1.8; 13 -3.445,-2.2; 14 -3.445,-2.6; 29 3.445,-2.6; 30 3.445,-2.2; 31 3.445,-1.8; 32 3.445,-1.4; 33 3.445,-1; 34 3.445,-0.6; 35 3.445,-0.2; 36 3.445,0.2; 37 3.445,0.6; 38 3.445,1; 39 3.445,1.4; 40 3.445,1.8; 41 3.445,2.2; 42 3.445,2.6 | smd 0.22 x 0.81: 15 -2.6,-3.445; 16 -2.2,-3.445; 17 -1.8,-3.445; 18 -1.4,-3.445; 19 -1,-3.445; 20 -0.6,-3.445; 21 -0.2,-3.445; 22 0.2,-3.445; 23 0.6,-3.445; 24 1,-3.445; 25 1.4,-3.445; 26 1.8,-3.445; 27 2.2,-3.445; 28 2.6,-3.445; 43 2.6,3.445; 44 2.2,3.445; 45 1.8,3.445; 46 1.4,3.445; 47 1,3.445; 48 0.6,3.445; 49 0.2,3.445; 50 -0.2,3.445; 51 -0.6,3.445; 52 -1,3.445; 53 -1.4,3.445; 54 -1.8,3.445; 55 -2.2,3.445; 56 -2.6,3.445 | smd 4 x 4: 57 0,0
SOT23-5 = smd 0.55 x 1.2: 1 -0.95,-1.3; 2 0,-1.3; 3 0.95,-1.3; 4 0.95,1.3; 5 -0.95,1.3
OLED_LUL_UG-2864HSWEG01_1.3_WRAPAROUND = smd 0.31 x 1.28 bottom: 1 -2.75,-0.22; 2 -2.25,-0.22; 3 -1.75,-0.22; 4 -1.25,-0.22; 5 -0.75,-0.22; 6 -0.25,-0.22; 7 0.25,-0.22; 8 0.75,-0.22; 9 1.25,-0.22; 10 1.75,-0.22; 11 2.25,-0.22; 12 2.75,-0.22 | smd 3.5 x 3 bottom: 31 -4.95,-2.46; 32 4.95,-2.46
M2_SCREW_FOOT = hole 2.5: 0,0
U.FL = smd 2.2 x 1.05: 1 0,1.375; 2 0,-1.375 | smd 0.8 x 1: 3 1.525,0
CRYSTAL-SMD-3.2X2.5MM = smd 1.2 x 1.1: 1 -1.175,-0.875; 2 1.175,-0.875; 3 1.175,0.875; 4 -1.175,0.875

### Placement (x,y rotation side)
BZ1  107.06,2.67 0 bottom
C1  99.77,83.44 90 bottom
C2  102.06,83.44 270 bottom
C3  83.9,59.05 180 bottom
C4  103.58,75.18 90 top
C5  87.33,59.31 0 bottom
C6  87.33,61.09 0 bottom
C7  91.39,56.77 270 bottom
C8  83.9,64.64 0 bottom
C9  98.25,60.33 180 bottom
C10  102.19,60.33 0 bottom
C11  54.31,34.04 270 bottom
C12  72.97,34.04 270 bottom
C13  23.38,14.86 90 bottom
C14  42.37,14.99 90 bottom
C15  61.93,14.99 90 bottom
C16  22.68,91.69 180 bottom
C17  41.73,91.82 180 bottom
C18  60.78,91.82 180 bottom
C19  36.08,71.31 0 bottom
C20  55.39,71.31 0 bottom
C21  73.17,71.31 0 bottom
C22  23.57,52.83 90 bottom
C23  42.75,52.96 90 bottom
C24  61.8,52.83 90 bottom
C25  35.51,34.04 270 bottom
C26  93.17,56.77 270 bottom
C27  81.97,80.3 90 top
C28  78.25,60.64 180 bottom
C29  81.87,84.38 90 top
C31  94.89,21.46 0 bottom
C33  82.31,16.2 90 bottom
C34  85.36,33.4 180 bottom
C35  91.08,16.2 90 bottom
C36  88.79,33.4 180 bottom
C37  86.63,36.7 180 bottom
C38  87.33,42.42 90 bottom
C39  89.1,42.42 90 bottom
C40  88.66,21.34 180 bottom
C41  3.76,91.69 180 bottom
C42  16.27,71.31 0 bottom
C43  3.7,53.72 180 bottom
C44  16.08,34.16 270 bottom
C45  4.27,14.99 90 bottom
C46  93.87,18.92 0 bottom
D1  89.17,19.05 0 bottom
D2  20.59,85.34 270 bottom
D3  39.89,85.22 270 bottom
D4  58.94,85.34 270 bottom
D5  76.47,86.61 0 bottom
D6  19.45,67.31 0 bottom
D7  38.37,67.31 0 bottom
D8  57.42,67.31 0 bottom
D9  76.47,67.31 0 bottom
D10  73.04,52.45 270 bottom
D11  57.42,48.51 0 bottom
D12  38.5,48.51 0 bottom
D13  19.45,48.51 0 bottom
D14  19.45,29.08 0 bottom
D15  38.5,29.08 0 bottom
D16  57.29,29.08 0 bottom
D17  69.48,20.32 180 bottom
D18  74.95,11.43 270 bottom
D19  57.55,10.92 0 bottom
D20  38.5,10.54 0 bottom
D21  19.45,10.79 0 bottom
D22  101.09,5.46 90 bottom
IC2  87,80.5 180 top
JP1  79.61,95.25 0 bottom
JP2  77.5,91.35 0 bottom
JP4  108.28,57 270 top
L2  83.96,20.07 180 bottom
LED_R1C1  10,91 180 top
LED_R1C2  29,91 180 top
LED_R1C3  48,91 180 top
LED_R1C4  67,91 180 top
LED_R2C1  10,72 0 top
LED_R2C2  29,72 0 top
LED_R2C3  48,72 0 top
LED_R2C4  67,72 0 top
LED_R3C1  10,53 180 top
LED_R3C2  29,53 180 top
LED_R3C3  48,53 180 top
LED_R3C4  67,53 180 top
LED_R4C1  10,34 0 top
LED_R4C2  29,34 0 top
LED_R4C3  48,34 0 top
LED_R4C4  67,34 0 top
LED_R5C1  10,15 180 top
LED_R5C2  29,15 180 top
LED_R5C3  48,15 180 top
LED_R5C4  67,15 180 top
Q1  96.27,6.48 270 bottom
R1  93.68,93.22 270 top
R2  88.03,71.95 180 bottom
R3  91.71,1.52 180 bottom
R4  98.06,17.27 0 bottom
R5  68.73,94.17 180 bottom
R6  90.95,21.46 90 bottom
R7  93.11,16.2 270 bottom
R8  98.12,83.44 270 bottom
R9  92.85,83.93 270 top
R10  89.04,16.2 90 bottom
R11  90.88,42.42 270 bottom
R12  88.79,35.05 0 bottom
R13  103.71,83.44 270 bottom
R14  98.25,58.67 180 bottom
R15  102.19,58.67 180 bottom
R16  95.52,70.99 0 bottom
R17  92.6,21.46 90 bottom
R18  99.33,20.07 90 bottom
R19  99.31,6.6 90 bottom
SD1  100.6,42.29 90 bottom
SH1  106.45,11.68 270 bottom
SW1  99.5,7 180 top
SW2  84,7 180 top
SW3  106.17,76 270 top
SW21  101,64 0 top
SW22  101,88 0 top
SWR1C1  10,86 180 top
SWR1C2  29,86 180 top
SWR1C3  48,86 180 top
SWR1C4  67,86 180 top
SWR2C1  10,67 180 top
SWR2C2  29,67 180 top
SWR2C3  48,67 180 top
SWR2C4  67,67 180 top
SWR3C1  10,48 180 top
SWR3C2  29,48 180 top
SWR3C3  48,48 180 top
SWR3C4  67,48 180 top
SWR4C1  10,29 180 top
SWR4C2  29,29 180 top
SWR4C3  48,29 180 top
SWR4C4  67,29 180 top
SWR5C1  10,10 180 top
SWR5C2  29,10 180 top
SWR5C3  48,10 180 top
SWR5C4  67,10 180 top
U1  105.17,26.42 270 bottom
U2  87,92.13 180 top
U3  80.98,52.32 0 bottom
U19  85.87,16.2 270 bottom
U$2  91.75,31 0 top
U$7  38.5,19.5 0 top
U$8  38.5,57.5 0 top
U$9  57.5,76.5 0 top
U$11  38.5,76.5 0 top
U$12  38.5,38.5 0 top
U$13  57.5,19.5 0 top
U$14  19.5,76.5 0 top
U$15  57.5,57.5 0 top
U$16  57.5,38.5 0 top
U$17  99,76.5 0 top
U$20  19.5,38.5 0 top
U$21  19.5,57.5 0 top
U$22  19.5,19.5 0 top
X1  88.03,56.56 270 bottom
X2  79.52,2.54 180 bottom
Y1  83.92,61.93 270 bottom

### Tracks (layer width: path | path; a pad name or v marks a point on that pad's centre or on a via)
12V
  Bottom 0.254: U$2.11 94,21.48 C31.2 | U$2.2 89.5,21.4 C40.2
  Bottom 0.305: C31.2 89.69,21.46 C40.2
  Bottom 0.406: C46.2 92.97,17.23 R7.1 C35.2 91.02,17.15 D1.C 91.15,18.92 C46.2 | C31.2 93.98,20.19 92.97,19.18 C46.2
+3V3  (via drill 0.5, 0.55, 0.7)
  Top 1.016: C27.1 83.68,78.9 85.23,77.35 IC2.4 86.97,77.38 IC2.2 | v81.17,76.96 81.17,78.09 C27.1 | v82.82,76.96 82.82,78.05 C27.1
  pwr 0.406: v103.14,14.22 105.17,12.19 v105.17,2.67
  Bottom 0.203: v79.14,62.61 v79.15,62.6 C28.2 79.58,60.21 U3.46 | v85.87,44.07 86.62,43.32 C38.2 C39.2 R11.1 92.91,43.32 SD1.4 | U$2.4 90.51,30.79 90.51,31.91 89.69,32.73 C36.2 89.54,33.4 R12.2 88.03,35.05 87.53,35.55 C37.2 v88.92,36.7 | U3.20 81.58,40.11 v83.84,37.85 | 85.03,57.46 86.43,58.85 C5.2 C6.2 86.43,67.03 v86.2,67.26 | v93.11,54.74 93.17,54.8 C26.2 C7.2 91.39,55.62 89.9,54.12 U3.3 83.57,54.12 83.57,54.52 U3.2 | R16.2 v94.63,69.22 | v85.74,72.01 87.07,72.01 R2.1 | 85.03,57.46 83.62,57.46 83.18,57.01 U3.55 | 85.03,57.46 83.58,56 U3.56 | BZ1.PLUS v105.17,2.67 105.17,1.41 104.39,0.64 101.73,0.64 101.09,1.27 D22.C
  Bottom 0.305: U19.4 U19.5 84.52,17.09 C33.2 82.41,17.09 83.25,16.26 v83.58,16.26
  Bottom 0.406: LED_R1C4.VDD 61.75,91.75 C18.2 61.74,91.88 v61.74,93.47 | LED_R1C1.VDD 7.34,91.69 C41.2 4.71,91.75 v4.71,93.34 | LED_R1C2.VDD 23.64,91.75 | 23.64,91.75 C16.2 | LED_R1C3.VDD 42.7,91.75 C17.2 42.69,91.88 v42.69,93.47 | LED_R3C4.VDD 64.38,53.73 C24.2 61.99,53.92 v61.99,55.12 | LED_R3C1.VDD 7.37,53.72 C43.2 4.6,54.75 v5.1,55.24 | LED_R3C3.VDD 42.86,53.75 | 42.86,53.75 C23.2 | LED_R3C2.VDD 23.59,53.75 | 23.59,53.75 C22.2 | LED_R4C3.VDD 54.19,33.25 C11.2 56.03,33.14 v56.28,32.89 | LED_R4C2.VDD 35.4,33.25 C25.2 37.49,33.14 v37.73,32.89 | LED_R5C2.VDD 23.39,15.75 C13.2 23.27,15.88 v20.59,15.88 | LED_R5C3.VDD 42.5,15.75 C14.2 43.07,16.59 v43.07,17.27 | LED_R5C4.VDD 62.06,15.75 C15.2 62.37,16.33 v62.37,17.27 | LED_R4C1.VDD 16.07,33.25 C44.2 17.68,33.26 v17.92,33.02 | LED_R5C1.VDD 4.4,15.75 C45.2 4.2,15.89 v3.06,17.02 | L2.1 82.31,19.91 C33.2 | C12.2 72.86,33.02 v71.52,33.02 71.29,33.25 LED_R4C4.VDD | v23.64,93.34 23.64,91.75 | v16.27,72.64 15.37,71.74 C42.2 12.66,71.31 LED_R2C1.VDD | v36.08,72.64 35.18,71.74 C19.2 35.13,71.25 LED_R2C2.VDD | v55.39,72.9 54.49,72 C20.2 50.66,71.31 LED_R2C3.VDD | v72.28,72.9 C21.2 69.66,71.31 LED_R2C4.VDD | v43.2,55.37 42.86,55.03 42.86,53.75 | v23.51,55.24 23.51,53.83 23.59,53.75
  Bottom 0.508: SH1.3 103.18,14.18 v103.14,14.22
  pour pwr (isolate 0.305): -7.48,107.7 126.13,107.7 126.13,-13.08 -7.48,-13.08
AUX_DN
  Bottom 0.152: U1.A7 102.51,26.17 102.76,26.42 102.76,26.92 102.52,27.17 U1.B7 99.95,27.17 97.88,25.09 97.88,14.68 97.17,13.97 81.8,13.97 81.18,14.6
  Bottom 0.203: U3.21 81.18,14.6
AUX_DP
  Bottom 0.152: U1.A6 100.09,26.67 99.97,26.54 99.97,25.67 | 99.97,25.67 U1.B6 | 99.97,25.67 99.14,25.67 98.24,24.77 98.24,14.28 97.42,13.46 81.17,13.46 80.78,13.86
  Bottom 0.203: 80.78,13.86 U3.22
CARD_DET
  Bottom 0.203: SD1.9 90.95,50.92 U3.11
COL0  (via drill 0.55)
  Top 0.203: v79.64,73.53 79.64,74.8 77.87,76.58 77.87,83.57 72.51,88.92 5.61,88.92 3.65,86.96 v3.65,80.92 v3.65,61.92 3.9,61.67 3.9,51.02 3.05,50.16 3.05,43.52 v3.65,42.92 v3.65,23.92 1.79,22.07 1.79,6.77 v3.65,4.92
  Bottom 0.203: v79.64,73.53 79.39,73.28 79.39,70.36 80.38,69.37 U3.48
COL1  (via drill 0.55)
  Top 0.203: v78.5,70.1 78.5,74.17 76.47,76.2 76.47,83.95 71.95,88.47 23.84,88.47 22.61,87.23 v22.61,80.9 v22.61,61.98 v22.6,61.97 22.6,42.97 SWR3C2.1 SWR4C2.1 SWR5C2.1
  Bottom 0.203: v78.5,70.1 79.98,68.63 U3.47 | SWR1C2.1 22.63,80.92 v22.61,80.9 | SWR2C2.1 v22.6,61.97
  other vias: 22.64,42.92 22.64,23.92 22.64,4.92
COL2  (via drill 0.55)
  Top 0.203: v77.99,64.64 77.23,65.41 77.23,73.41 67.58,83.06 60.59,83.06 58.69,81.15 49.02,81.15 46.99,83.19 42.67,83.19 41.65,82.16 v41.65,80.92 v41.65,61.92 v41.65,42.92 v41.65,23.92 v41.65,4.92
  Bottom 0.203: U3.44 78.78,56.49 75.96,59.31 75.96,62.1 77.99,64.14 v77.99,64.64
COL3  (via drill 0.55)
  Top 0.203: v60.65,80.92 v60.65,61.85 v60.65,42.92 v60.65,23.92 v60.65,4.92
  Bottom 0.203: U3.43 78.38,56.13 76.22,58.29 62.63,58.29 60.65,60.27 v60.65,61.85 SWR2C4.1
DC
  Bottom 0.203: U3.17 82.78,41.7 85.36,39.12 89.68,39.12 91.71,37.08 91.71,33.3 92.5,32.51 U$2.8
GND  (via drill 0.5)
  gnd 0.406: v95.71,15.62 98.93,15.62 102.23,12.32 102.23,9.78 100.53,8.08 v100.53,5.59
  Bottom 0.203: LED_R3C4.GND 70.15,52.25 71.58,53.68 v71.58,54.99 | LED_R1C4.GND 69.6,89.14 69.36,88.9 55.45,88.9 v54.31,90.04 | v80.72,86.61 80.72,87.05 78.36,89.41 74.8,89.41 71.88,92.33 71.88,94.49 70.87,95.5 68.33,95.5 67.83,95.01 R5.1 | Q1.2 97.54,5.7 R19.1 100.42,5.7 v100.53,5.59
  Bottom 1.905: SH1.FIT@1 SH1.FIT@2
  other vias: 95.33,75.69 80.98,52.32 73.48,15.37 74.12,72.9 35,90.17 17.35,90.3 19.13,72.52 38.94,72.26 58.24,72.64 36.91,51.94 56.21,51.94 17.22,51.69 36.4,13.84 56.59,13.72 17.09,13.84 69.29,61.09 75.26,2.92 36.02,94.87 11.13,77.09 30.68,77.09 49.48,76.33 74.37,79.38 51,59.56 30.94,59.82 12.14,59.82 2.87,55.24 30.43,39.5 11.13,39.24 49.48,38.73 65.23,38.23 69.55,22.48 49.86,20.57 31.45,21.21 11.13,20.95 15.7,2.67 84.53,24.26 84.28,68.45 77.29,61.98
  pour Top (isolate 0.305): -5,103 -5,-10 122,-10 122,103
  pour Bottom (isolate 0.305): 132,116.13 132,-20.35 -17,-20.35 -17,116.13
  pour Top (isolate 0.305, no thermals): 78.18,10.29 89.74,10.29 89.74,8.13 78.18,8.13
  pour Top (isolate 0.305, no thermals): 93.68,10.29 105.11,10.29 105.11,8.13 93.68,8.13
  pour Bottom (isolate 0.305, no thermals): 82.63,65.91 88.85,65.91 88.85,58.42 82.63,58.42
  pour Bottom (isolate 0.305, no thermals): 85.93,59.05 93.68,59.05 93.68,54.61 85.93,54.61
  pour Bottom (isolate 0.305, no thermals): 77.29,5.21 85.8,5.21 85.8,-0.76 77.29,-0.76
  pour gnd (isolate 0.305): -12.81,111.38 129.05,111.38 129.05,-16.89 -12.81,-16.89
  pour Bottom (isolate 0.305, no thermals): 81.61,22.35 96.98,22.35 96.98,13.72 81.61,13.72
HEHE
  Bottom 0.203: U3.27 78.78,47.76 79.5,47.03 79.5,11.42 80.46,10.46 100.78,10.46 103.5,13.18 SH1.4
MOSI
  Bottom 0.203: U3.15 83.58,42.42 85.87,40.13 90.19,40.13 92.73,37.59 92.73,33.93 93.5,33.16 U$2.10
N$1
  Top 0.508: JP2.1 80.08,91.31 84.16,91.31 84.89,90.58 84.89,89.59 84.58,89.27 U2.B4A9 84.58,86.83 85.17,86.23 88.79,86.23 89.42,86.87 U2.A4B9
  Bottom 0.508: JP2.1 80.04,95.23 JP1.1
N$2
  Bottom 0.203: LED_R1C4.DOUT 56.38,90.25 54.88,91.75 LED_R1C3.DIN
N$3
  Bottom 0.203: LED_R1C2.DIN 36.22,91.75 37.72,90.25 LED_R1C3.DOUT
N$4
  Bottom 0.203: LED_R1C2.DOUT 21.08,90.25 19.58,91.75 LED_R1C1.DIN
N$5
  Bottom 0.203: LED_R1C1.DOUT 2.44,90.25 0.84,88.65 0.84,74.8 4.39,71.25 LED_R2C1.DIN
N$6
  Bottom 0.203: LED_R2C1.DOUT 13.49,73.64 20.04,73.64 22.43,71.25 LED_R2C2.DIN
N$7
  Bottom 0.203: LED_R2C2.DOUT 32.62,73.77 39.59,73.77 42.11,71.25 LED_R2C3.DIN
N$8
  Bottom 0.203: U$2.3 90,31.58 89.45,32.13 87.27,32.13 86.26,33.14 C34.2
N$9
  Bottom 0.203: LED_R2C3.DOUT 51.62,73.77 58.65,73.77 61.16,71.25 LED_R2C4.DIN
N$10
  Bottom 0.203: U$2.5 91,22.41 R6.2
N$11
  Bottom 0.203: LED_R3C4.DIN 69.6,54.94 68.15,56.39 61.29,56.39 59.26,54.36 56.21,54.36 54.05,56.52 42.49,56.52 40.08,54.1 37.29,54.1 35,56.39 22.3,56.39 20.52,54.61 15.7,54.61 13.79,56.52 1.6,56.52 0.84,57.28 0.84,66.17 4.58,69.91 75.2,69.91 75.77,70.48 75.77,72.39 74.14,74.02 70.87,74.02 LED_R2C4.DOUT
N$12
  Bottom 0.203: LED_R3C4.DOUT 63.27,52.25 62.69,52.83 54.05,52.83 53.13,53.75 LED_R3C3.DIN
N$13
  Bottom 0.203: LED_R3C3.DOUT 44.35,52.25 43.64,52.96 34.62,52.96 33.83,53.75 LED_R3C2.DIN
N$14
  Bottom 0.203: U3.9 96.63,51.72 97.11,52.2 97.11,58.43 R14.1 99,60.33 C9.2
N$15
  Bottom 0.203: LED_R3C2.DOUT 25.42,52.25 24.84,52.83 16.59,52.83 15.67,53.75 LED_R3C1.DIN
N$16
  Bottom 0.203: LED_R3C1.DOUT 2.54,52.25 0.71,50.42 0.71,35.31 2.77,33.25 LED_R4C1.DIN
N$17
  Bottom 0.203: LED_R4C2.DIN 19.66,33.25 18.79,34.12 14.25,34.12 13.62,34.75 LED_R4C1.DOUT
N$18
  Bottom 0.203: LED_R4C2.DOUT 33.15,34.75 33.86,34.04 39.45,34.04 40.23,33.25 LED_R4C3.DIN
N$19
  Bottom 0.203: LED_R4C3.DOUT 52.07,34.75 52.78,34.04 57.1,34.04 57.89,33.25 LED_R4C4.DIN
N$20
  Bottom 0.203: LED_R4C4.DOUT 71.37,34.75 72.09,34.04 73.93,34.04 74.18,33.78 74.18,32.45 73.67,31.94 4.21,31.94 0.84,28.57 0.84,20.57 4.01,17.4 15.64,17.4 16.4,16.64 20.21,16.64 20.97,17.4 34.49,17.4 35.36,16.54 39.98,16.54 41.86,18.41 53.42,18.41 55.7,16.13 59.01,16.13 61.16,18.29 68.02,18.29 69.6,16.71 LED_R5C4.DIN
N$21
  Bottom 0.203: LED_R5C4.DOUT 63.42,14.25 62.69,14.99 54.31,14.99 53.54,15.75 LED_R5C3.DIN
N$22
  Bottom 0.203: LED_R5C3.DOUT 44.12,14.25 43.38,14.99 34.88,14.99 34.11,15.75 LED_R5C2.DIN
N$23
  Bottom 0.203: LED_R5C2.DOUT 24.94,14.25 24.33,14.86 17.98,14.86 17.09,15.75 LED_R5C1.DIN
N$24
  Bottom 0.203: C8.1 Y1.1 83.9,62.2 83.9,58.42 82.78,57.3 U3.54
N$25
  Bottom 0.203: Y1.3 83.05,59.1 C3.1 82.38,58.43 U3.53
N$26
  Bottom 0.203: U3.1 85.3,54.92
  Bottom 0.343: 85.3,54.92 87.93,54.92 X1.3
N$27  (via drill 0.55)
  Bottom 0.254: SWR1C4.2 D5.A
  other vias: 74.62,83.46
N$28
  Bottom 0.203: SW22.D 98.5,86.74 91.64,79.88 91.64,61.72 94.82,58.55 94.82,53.72 94.42,53.32 U3.5
N$29
  Bottom 0.203: LED_R1C4.DIN 71.46,91.75 74.31,88.9 77.99,88.9 79.52,87.38 79.52,76.71 81.98,74.25 U3.52
  Bottom 0.254: R5.2 69.63,91.78 LED_R1C4.DIN
N$30  (via drill 0.5)
  Top 0.203: v100.48,11.43 v100.47,11.43 99.33,10.29 99.33,7.62
  Top 0.305: SW1.B' 96.1,7.62 99.33,7.62 101.62,7.62 101.62,4.75 SW1.B
  Bottom 0.203: v100.48,11.43 100.18,11.12 82.24,11.12 80.38,12.98 U3.23
N$31
  Top 0.152: U2.B5 85.25,89.11 85.67,89.53 85.67,92.58 87.96,94.87 92.92,94.87 R1.1
N$32
  Bottom 0.152: U1.A5 99.79,27.67 97.16,25.03 R4.2
N$33
  Top 0.203: U2.A5 88.25,89.95 89.1,90.81 91.9,90.81 92.53,90.17 92.53,85.15 R9.1
N$34
  Bottom 0.203: R8.2 98.12,80.88 SW22.A
N$35
  Bottom 0.203: R13.2 103.71,80.71 SW22.B
N$36
  Bottom 0.406: U19.1 87.32,17.3 D1.A 85.59,19.05 85.46,19.18 L2.2
N$37
  Bottom 0.203: BZ1.MINUS 103.06,4.63 101.09,6.6 | Q1.3 100.97,6.48 101.09,6.6 | 101.09,6.6 D22.A
N$38
  Bottom 0.203: U3.6 94.91,52.92 95.33,53.34 95.33,58.93 92.23,62.03 92.23,78.69 97.88,84.34 R8.1 C1.2
N$39
  Bottom 0.406: U19.3 88.99,15.24 R10.1 C35.1 R7.2
N$40
  Bottom 0.203: U3.7 95.4,52.52 95.83,52.96 95.83,59.18 92.79,62.23 92.79,76.33 95.45,78.99 101.93,78.99 102.26,79.32 102.26,82.34 C2.2 103.71,84.19 R13.1
N$41
  Top 0.203: JP4.2 107.37,56.59 98.5,65.46 SW21.D
  Bottom 0.203: U3.8 96.02,52.12 96.34,52.45 96.34,61.21 98.5,63.37 SW21.D R16.1
N$42
  Bottom 0.203: R15.2 103.5,58.26 SW21.B
N$43
  Bottom 0.203: R11.2 91.21,41.19 SD1.2
N$44  (via drill 0.55)
  Bottom 0.254: SWR1C3.2 58.91,83.46 D4.A
  other vias: 55.62,83.46
N$45  (via drill 0.55)
  Bottom 0.254: SWR1C2.2 39.8,83.46 D3.A
  other vias: 36.62,83.46
N$46  (via drill 0.55)
  Bottom 0.254: SWR1C1.2 20.56,83.46 D2.A
  other vias: 17.62,83.46
N$47  (via drill 0.55)
  Bottom 0.203: D9.A SWR2C4.2
  other vias: 74.62,64.46
N$48
  Bottom 0.203: R14.2 99.15,57.15 SW21.A
N$49
  Bottom 0.203: U3.10 97.76,51.32 99.77,53.34 99.77,57.4 101.04,58.67 R15.1 C10.2
N$50  (via drill 0.55)
  Bottom 0.203: D8.A 55.62,67.31 SWR2C3.2
  other vias: 55.62,64.46
N$51  (via drill 0.55)
  Bottom 0.203: D7.A 36.52,64.46 SWR2C2.2
  other vias: 36.62,64.46
N$52  (via drill 0.55)
  Bottom 0.254: D6.A 17.62,67.28 SWR2C1.2
  other vias: 17.62,64.46
N$53  (via drill 0.55)
  Bottom 0.203: SWR3C4.2 73.3,46.79 73.3,48.7 73.04,48.95 D10.A
  other vias: 74.62,45.46
N$54  (via drill 0.55)
  Bottom 0.203: SWR3C3.2 55.62,48.51 D11.A
  other vias: 55.62,45.46
N$55  (via drill 0.55)
  Bottom 0.203: SWR3C2.2 36.62,48.51 D12.A
  other vias: 36.62,45.46
N$56  (via drill 0.55)
  Bottom 0.203: SWR3C1.2 17.62,48.51 D13.A
  other vias: 17.62,45.46
N$57  (via drill 0.55)
  Bottom 0.203: D17.A 71.33,23.57 74.23,26.46 SWR4C4.2
  other vias: 74.62,26.46
N$58  (via drill 0.55)
  Bottom 0.203: SWR4C3.2 55.62,29.08 D16.A
  other vias: 55.62,26.46
N$59  (via drill 0.55)
  Bottom 0.203: SWR4C2.2 36.62,29.08 D15.A
  other vias: 36.62,26.46
N$60  (via drill 0.55)
  Bottom 0.203: SWR4C1.2 17.62,29.08 D14.A
  other vias: 17.62,26.46
N$61  (via drill 0.55)
  Bottom 0.203: D18.A 74.95,7.46 v74.68,7.46 SWR5C4.2
N$62  (via drill 0.55)
  Bottom 0.203: SWR5C3.2 55.62,10.92 D19.A
  other vias: 55.62,7.46
N$63  (via drill 0.55)
  Bottom 0.203: SWR5C2.2 36.62,10.54 D20.A
  other vias: 36.62,7.46
N$64  (via drill 0.55)
  Bottom 0.203: SWR5C1.2 17.62,10.79 D21.A
  other vias: 17.62,7.46
N$65  (via drill 0.5)
  Top 0.203: v80.92,11.3 82.69,11.3 83.96,10.03 83.96,7.62
  Top 0.305: SW2.B' 80.6,7.62 83.96,7.62 87.4,7.62 SW2.B
  Bottom 0.203: v80.92,11.3 79.98,12.24 U3.24
N$66  (via drill 0.6)
  Top 0.508: 84.67,83.63 IC2.3 | JP2.2 77.5,87.84 80.06,85.28 C29.2
  Top 0.61: C29.2 83.02,85.28 84.67,83.63
  pwr 0.61: v99.58,28.96 88.92,39.62 88.92,93.6 87.27,95.25 79.01,95.25 77.5,93.74 JP2.2
  Bottom 0.508: U1.A4B9 102.26,28.84 103.65,27.46 103.65,25.4 | 103.65,25.4 102.24,23.99 U1.B4A9 | SH1.1 104.41,16.3 104.41,24.64 103.65,25.4 | JP2.2 77.5,93.54 JP1.2
  Bottom 0.61: U1.A4B9 99.7,28.84 v99.58,28.96
N$67
  Bottom 0.203: U3.36 76.8,52.52 76.47,52.2 76.47,49.4 79.03,46.84 79.03,10.95 80.03,9.96 101.16,9.96 103.39,12.18 SH1.5
N$68
  Bottom 0.203: U3.37 76.31,52.92 75.89,52.5 75.89,49.2 78.55,46.53 78.55,10.57 79.72,9.4 101.62,9.4 103.4,11.18 SH1.6
N$69
  Bottom 0.203: U3.38 75.95,53.32 75.25,52.63 75.25,49 78.07,46.18 78.07,10.21 79.39,8.89 102.12,8.89 103.42,10.18 SH1.7
N$70
  Bottom 0.203: U3.39 75.58,53.72 74.69,52.83 74.69,48.77 77.59,45.87 77.59,9.8 79.01,8.38 99.31,8.38 | 99.31,8.38 102.76,8.38 103.56,9.18 SH1.8 | Q1.1 97.44,7.5 R19.2 99.31,8.38
N$71
  Bottom 0.343: R3.1 81.24,2.34 X2.3
N$72  (via drill 0.5)
  pwr 0.203: v80.66,72.26 81.3,71.63 81.3,69.22 75.56,63.48 75.56,18.81 83.45,10.92 98.06,10.92 101.74,7.24 v102.63,7.24
  Bottom 0.203: U3.50 81.18,71.75 v80.66,72.26 | SH1.9 103.7,8.18 102.76,7.24 v102.63,7.24
N$73  (via drill 0.5)
  pwr 0.203: v80.28,70.99 80.28,68.85 73.68,62.25 73.68,19.94 83.19,10.42 97.4,10.42 101.73,6.1 v103.38,6.1
  Bottom 0.203: U3.49 80.78,70.5 v80.28,70.99 | SH1.10 104.47,7.18 v103.38,6.1
N$80
  Bottom 0.152: U1.B5 99.87,24.67 99.33,24.13 R18.2
OLED_CS
  Bottom 0.203: U3.19 81.98,40.98 84.85,38.1 89.17,38.1 89.69,37.58 R12.1 90.07,35.05 90.69,34.43 90.69,32.69 91.5,31.88 U$2.6
OLED_RESET
  Bottom 0.203: R17.2 92.6,23.12 92,23.72 U$2.7 92,32.15 91.2,32.94 91.2,36.83 89.42,38.61 85.11,38.61 82.38,41.34 U3.18
RESET  (via drill 0.5)
  Top 0.203: v90.63,72.01 92.03,73.41 102.7,73.41 C4.1 106.16,74.28 SW3.P$2 105.79,73.92 105.79,68.83 104.52,67.56 104.52,61.16 JP4.1
  Bottom 0.203: U3.4 93.93,53.72 94.25,54.04 94.25,58.35 90.63,61.98 v90.63,72.01 90.57,71.95 R2.2
ROW0
  Bottom 0.203: U3.51 81.58,73.76 78.32,77.02 D5.C 78.32,87.25 77.18,88.39 58.94,88.39
  Bottom 0.254: D2.C 21.79,88.39 39.89,88.39 | 39.89,88.39 58.94,88.39 D4.C | D3.C 39.89,88.39
ROW1
  Bottom 0.203: D6.C 23.46,69.47 40.22,69.47 40.22,69.41 | 40.22,69.41 59.27,69.41 | 59.27,69.41 75.9,69.41 77.99,67.31 D9.C 78.88,66.75 78.88,63.88 78.25,63.25 78.25,59.05 79.18,58.13 U3.45 | D7.C 40.22,69.41 | D8.C 59.27,69.41
ROW2
  Bottom 0.203: U3.42 73.66,54.92 D10.C 71.14,52.4 71.14,51.51 70.56,50.93 59.27,50.93 | D13.C 23.71,50.93 40.35,50.93 | 40.35,50.93 59.27,50.93 | D12.C 40.35,50.93 | D11.C 59.27,50.93
ROW3
  Bottom 0.203: D14.C 23.65,31.43 40.35,31.43 | 40.35,31.43 59.14,31.43 | 59.14,31.43 73.87,31.43 74.69,32.26 74.69,35.94 64.15,46.48 64.15,49.28 65.29,50.42 71.01,50.42 71.69,51.1 71.69,51.74 72.79,52.83 73.04,52.83 74.73,54.52 U3.41 | D15.C 40.35,31.43 | 59.14,31.43 D16.C 59.45,29.08 61.99,26.54 65.55,26.54 67.64,24.46 D17.C
ROW4
  Bottom 0.203: D21.C 23.2,12.7 40.35,12.7 | 40.35,12.7 59.4,12.7 | 59.4,12.7 74.37,12.7 D18.C 74.95,21.34 76.85,23.24 76.85,35.69 68.72,43.81 68.72,46.35 72.23,49.86 72.23,51.38 74.97,54.12 U3.40 | D20.C 40.35,12.7 | D19.C 59.4,12.7
SCLK
  Bottom 0.203: U3.16 83.18,42.06 85.61,39.62 89.93,39.62 92.22,37.34 92.22,33.6 93,32.82 U$2.9
SD_CLK
  Bottom 0.203: U3.13 86.42,50.12 92.05,44.49 SD1.5
SD_CMD
  Bottom 0.203: U3.14 84.42,43.87 85.87,42.42 92.85,42.42 SD1.3
SD_D0
  Bottom 0.203: U3.12 87.8,50.52 91.63,46.69 SD1.7
USB_DN  (via drill 0.35, 0.5)
  Top 0.203: U2.A7 86.75,87.19 86.94,87 87.58,87 87.75,87.17 U2.B7 87.75,91.16 v87.77,91.19
  pwr 0.203: v87.77,91.19 87.77,54.3 v83.38,49.91
  Bottom 0.203: U3.25 79.58,49.59 79.77,49.78 83.25,49.78 v83.38,49.91
USB_DP  (via drill 0.35, 0.5)
  Top 0.203: U2.B6 86.25,89.54 v86.76,90.04 87.25,89.55 U2.A6
  pwr 0.203: v86.76,90.04 87.14,89.66 87.14,54.86 82.21,49.94 v78.55,49.94
  Bottom 0.203: v78.55,49.94 78.68,49.81 79.06,49.81 79.18,49.69 U3.26
WTF2
  cutout gnd: 80.53,7.37 111.01,7.37 111.01,-0.76 80.53,-0.76
  cutout pwr (no thermals): 80.03,7.62 109.49,7.62 109.49,-0.51 80.03,-0.51

### Text on the board
tNames: - | +
bNames: PSW | duckyPad Pro / dekuNukem / AUG2026 / R2 | UFL1 | SH1 | UFL2 | ANT1 | * | BZ1
tDocu: watch out for strapping pins / GPIO3 must have pull resistor, pull to high to free up JTAG pins? / / 3.5mm corner radius / / double check RESET jumper has NO PASTE